# EAGLE design FMC_prototype (EAGLE 6.5.0)
DESIGNER: OPEN EPHYS; DESIGN_NAME: FMC ACQUISITION ADAPTER; REVISION: 0.1
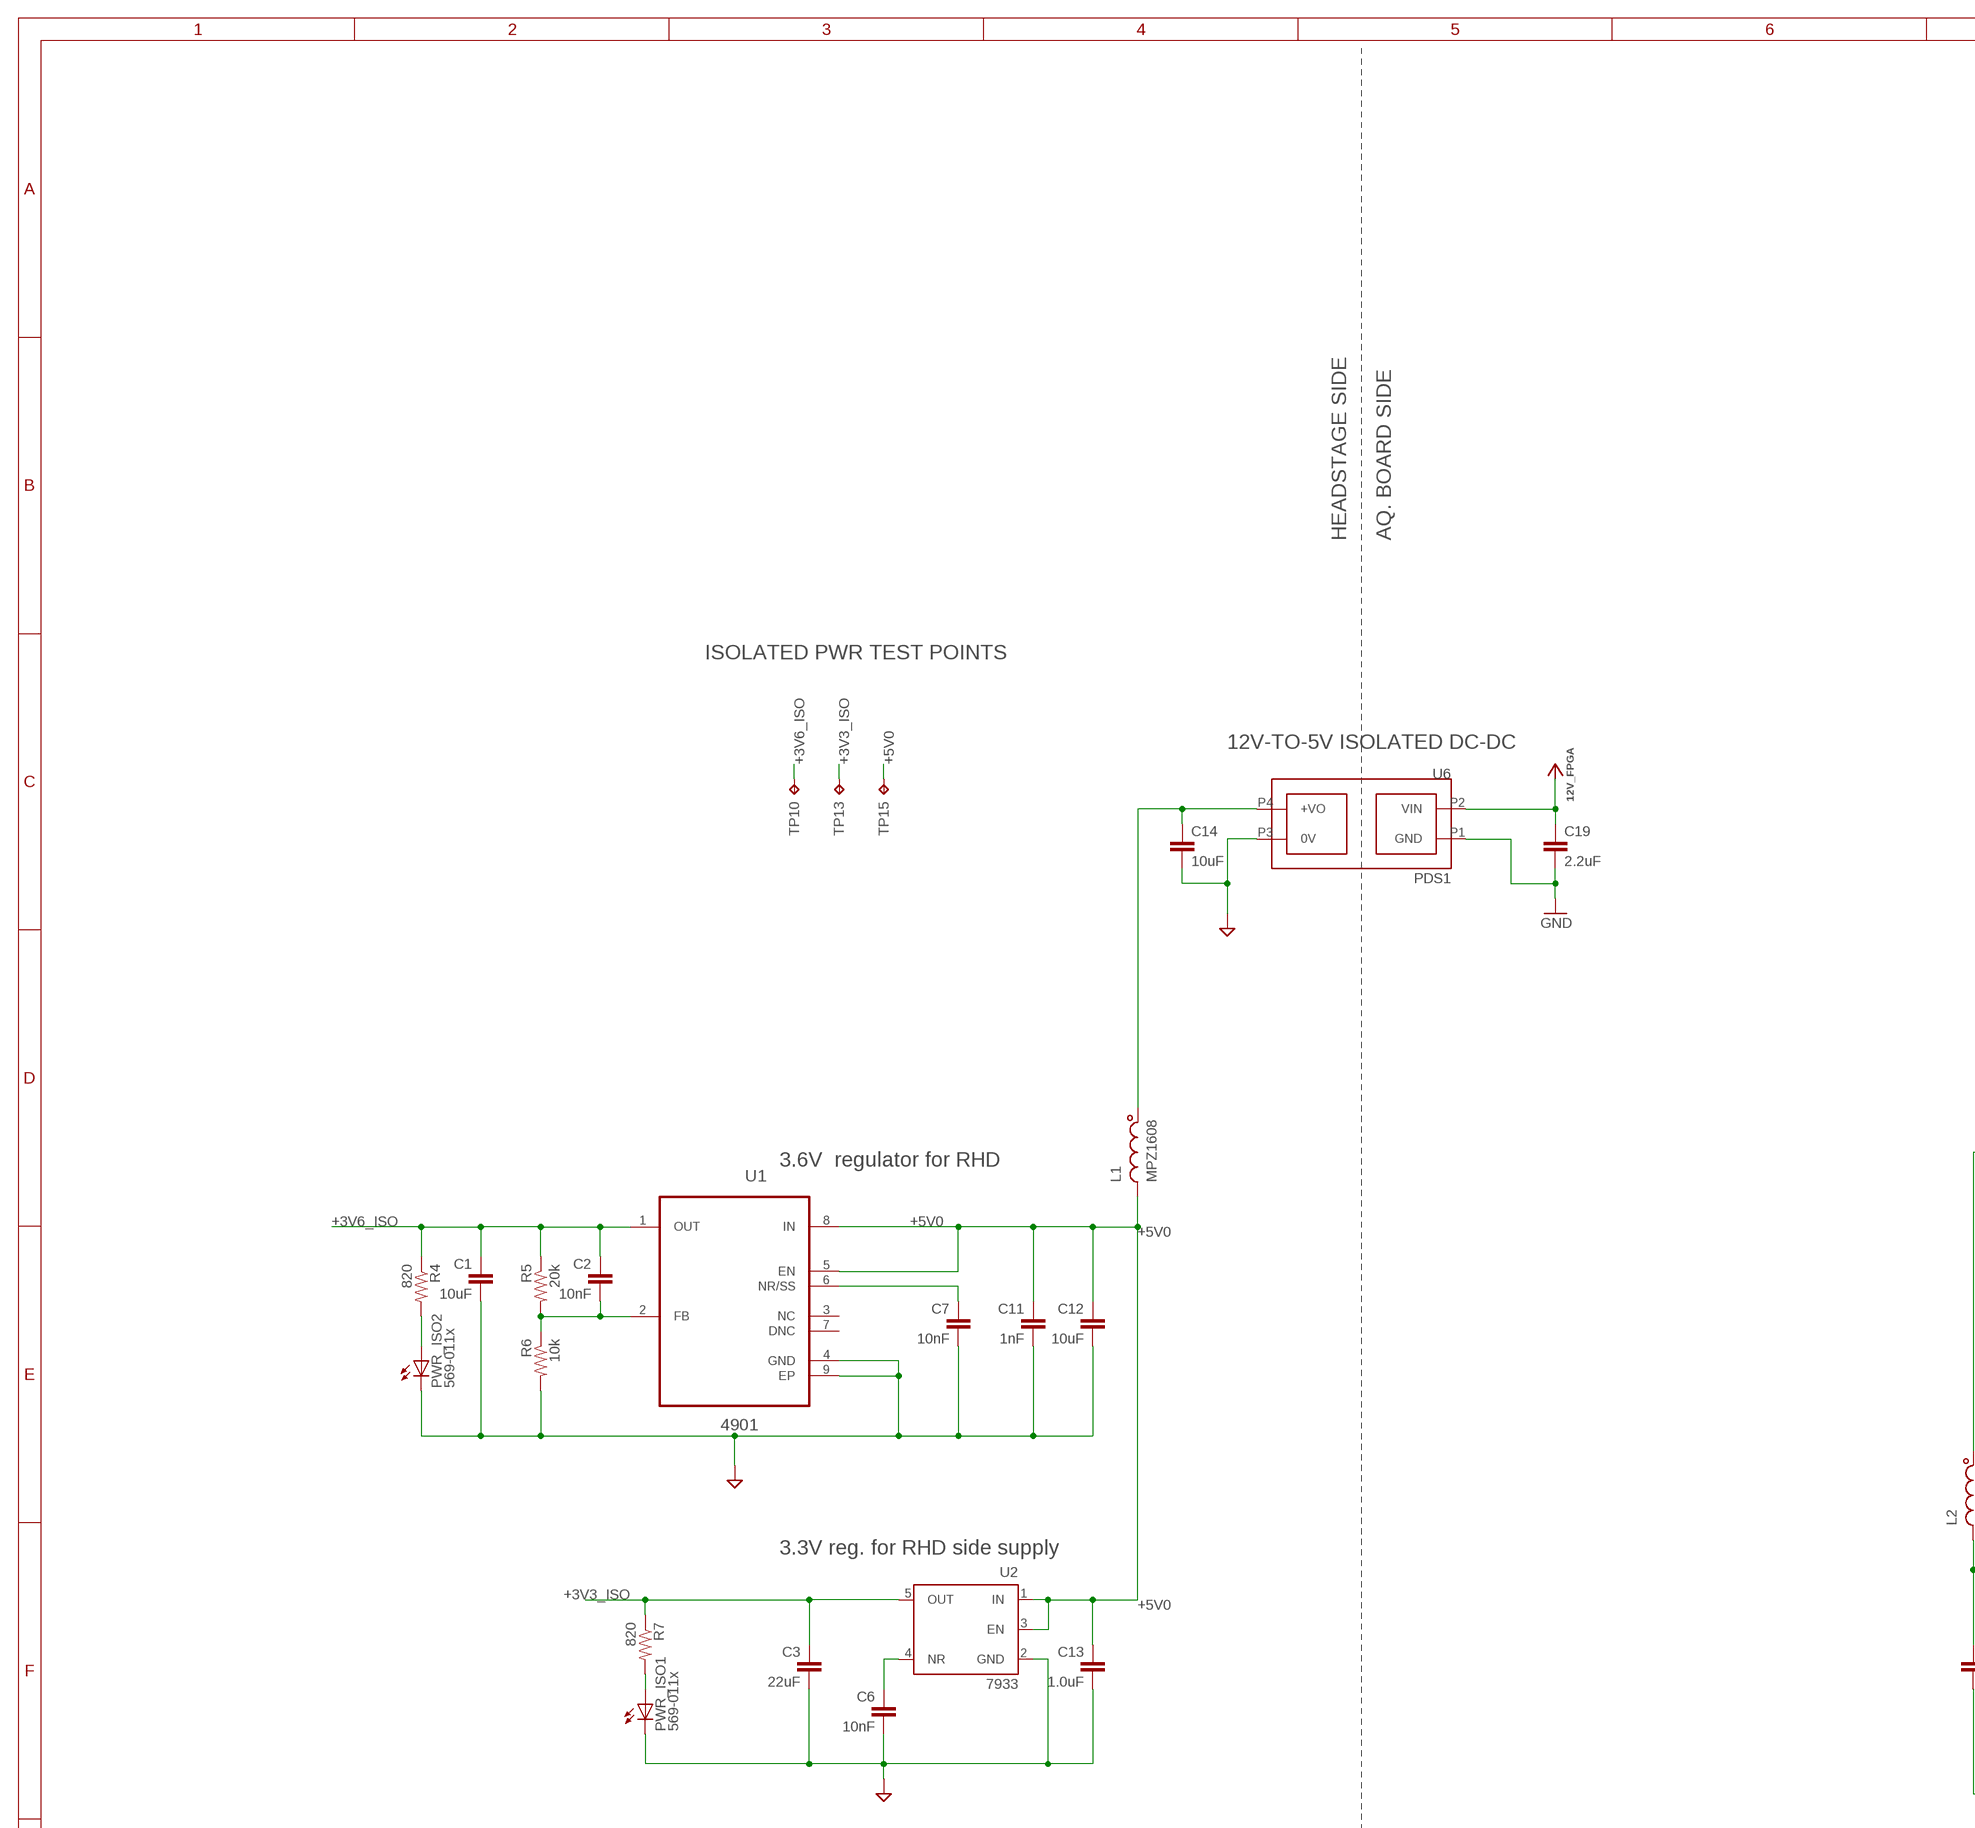
[diagram p0: schematic, sheet 1, part 1 of 3]
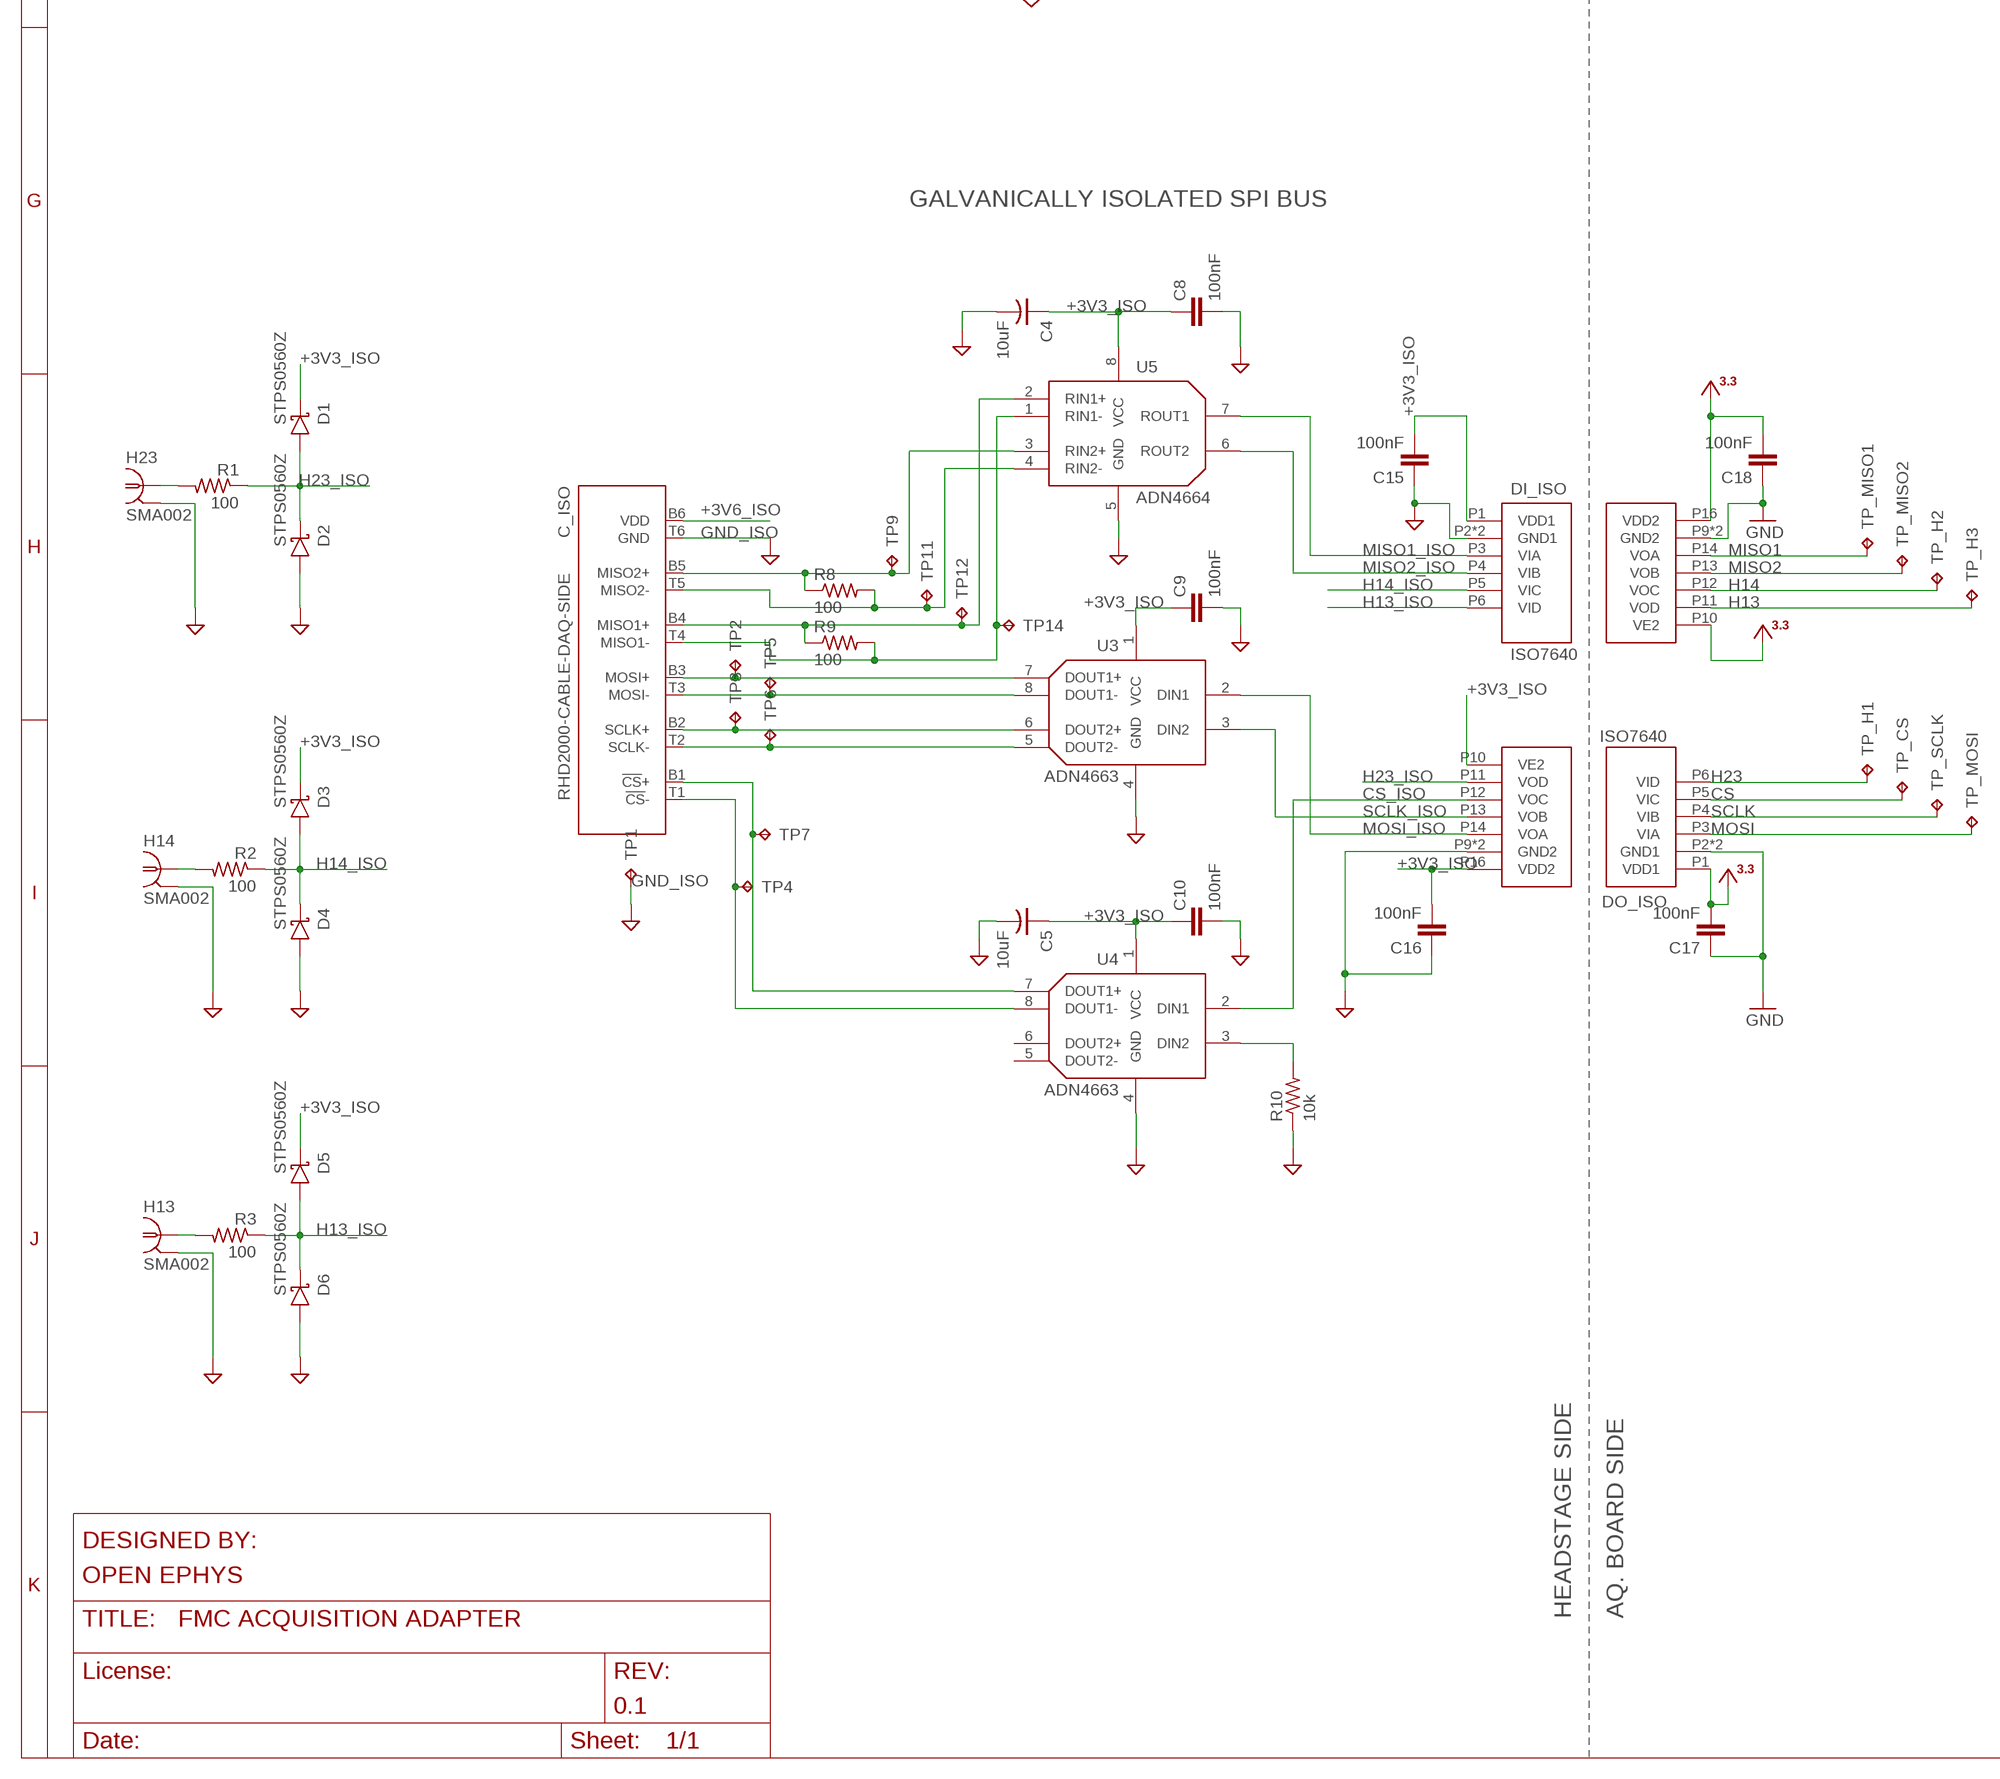
[diagram p1: schematic, sheet 1, part 2 of 3]
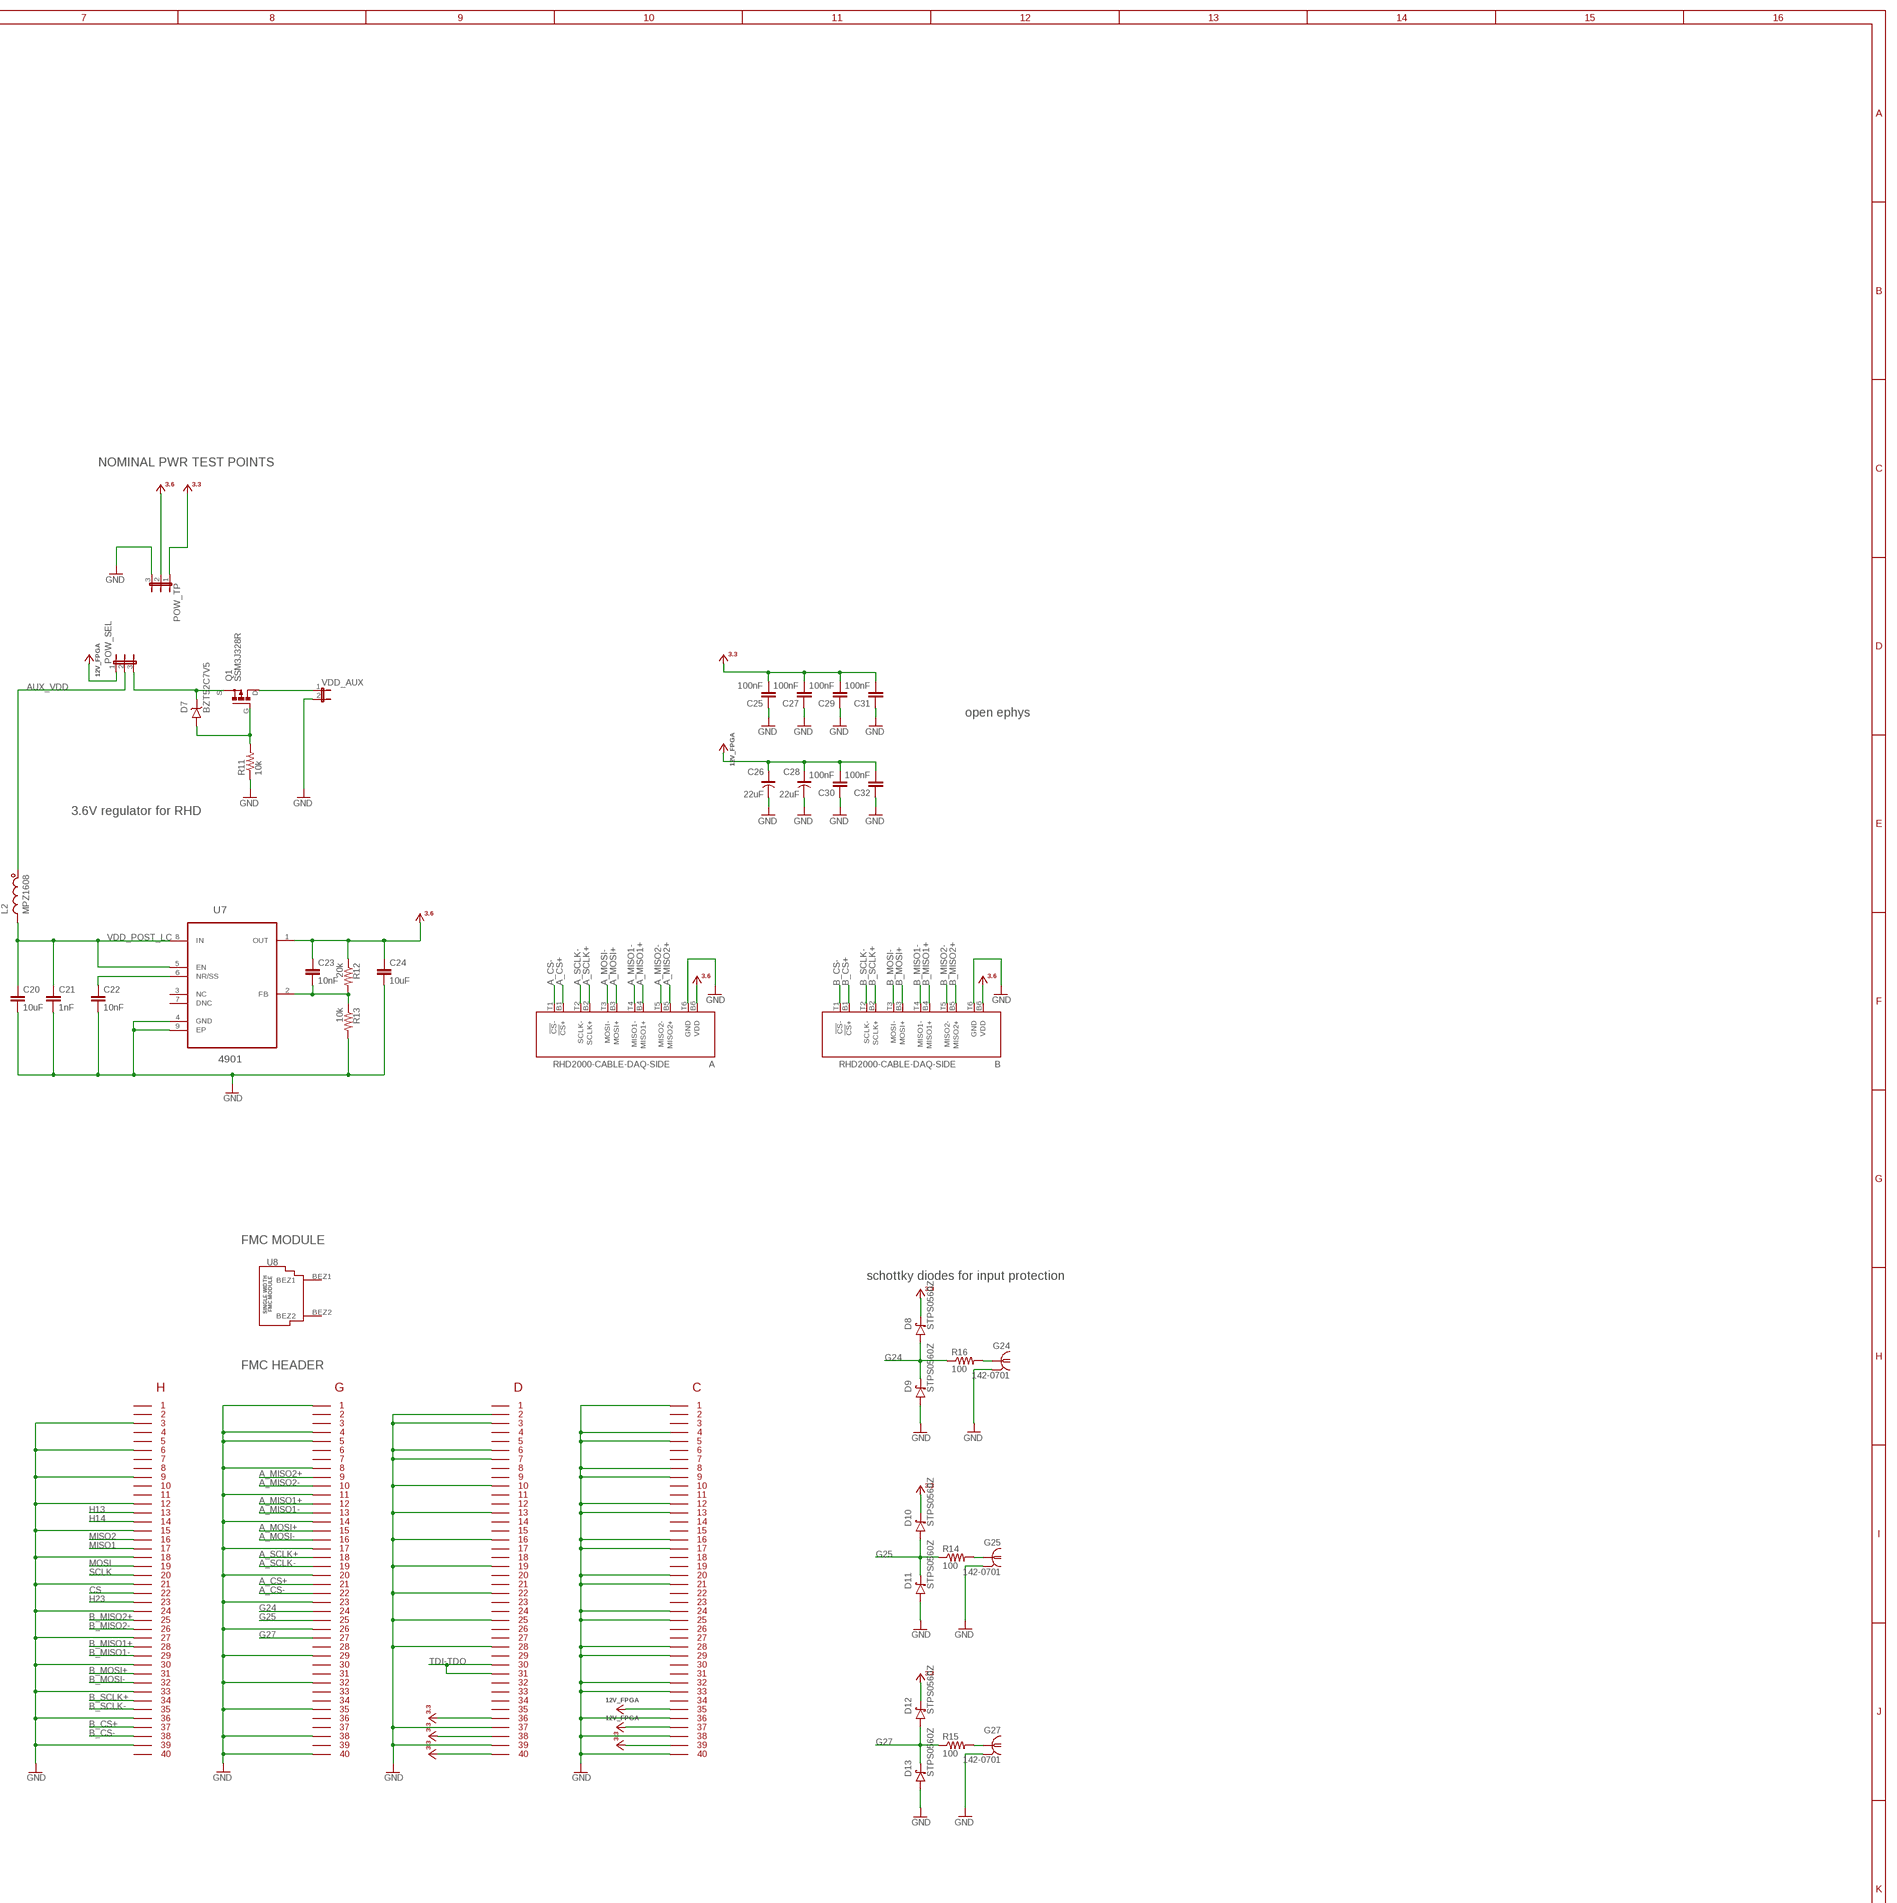
[diagram p2: schematic, sheet 1, part 3 of 3]

## Parts
A  RHD2000-CABLE-DAQ-SIDE  [OMNETICS_PZN-12-AA]
B  RHD2000-CABLE-DAQ-SIDE  [OMNETICS_PZN-12-AA]
C1  10uF  C_1206  [1206]
C2  10nF  C_0603  [0603]
C3  22uF  C_1206  [1206]
C4  10uF  C-POL_1206  [1206-POL]
C5  10uF  C-POL_1206  [1206-POL]
C6  10nF  C_0603  [0603]
C7  10nF  C_0603  [0603]
C8  100nF  C_0603  [0603]
C9  100nF  C_0603  [0603]
C10  100nF  C_0603  [0603]
C11  1nF  C_0603  [0603]
C12  10uF  C_1206  [1206]
C13  1.0uF  C_0805  [0805]
C14  10uF  C_1206  [1206]
C15  100nF  C_0603  [0603]
C16  100nF  C_0603  [0603]
C17  100nF  C_0603  [0603]
C18  100nF  C_0603  [0603]
C19  2.2uF  C_1206  [1206]
C20  10uF  C_1206  [1206]
C21  1nF  C_0603  [0603]
C22  10nF  C_0603  [0603]
C23  10nF  C_0603  [0603]
C24  10uF  C_1206  [1206]
C25  100nF  C_0603  [0603]
C26  22uF  C-POL_1210  [1210-POL]
C27  100nF  C_0603  [0603]
C28  22uF  C-POL_1210  [1210-POL]
C29  100nF  C_0603  [0603]
C30  100nF  C_0603  [0603]
C31  100nF  C_0603  [0603]
C32  100nF  C_0603  [0603]
C_ISO  RHD2000-CABLE-DAQ-SIDE  [OMNETICS_PZN-12-AA]
D1  STPS0560Z  S-DIODESOD-123  [SOD123]
D2  STPS0560Z  S-DIODESOD-123  [SOD123]
D3  STPS0560Z  S-DIODESOD-123  [SOD123]
D4  STPS0560Z  S-DIODESOD-123  [SOD123]
D5  STPS0560Z  S-DIODESOD-123  [SOD123]
D6  STPS0560Z  S-DIODESOD-123  [SOD123]
D7  BZT52C7V5  Z-DIODE_SOD123  [SOD123]
D8  STPS0560Z  S-DIODESOD-123  [SOD123]
D9  STPS0560Z  S-DIODESOD-123  [SOD123]
D10  STPS0560Z  S-DIODESOD-123  [SOD123]
D11  STPS0560Z  S-DIODESOD-123  [SOD123]
D12  STPS0560Z  S-DIODESOD-123  [SOD123]
D13  STPS0560Z  S-DIODESOD-123  [SOD123]
DI_ISO  ISO7640  ADUM3440  [SOIC_WIDE_16]
DO_ISO  ISO7640  ADUM3440  [SOIC_WIDE_16]
FMC  FMC_LPC_160_PIN  [FMC_LPC_MALE_WITH_SP601_BSILK]
G24  142-0701  COAX_SMA-VERT  [SMA_JACK_142-0701-201]
G25  142-0701  COAX_SMA-VERT  [SMA_JACK_142-0701-201]
G27  142-0701  COAX_SMA-VERT  [SMA_JACK_142-0701-201]
H13  SMA002  COAX_CONREVSMA002-G  [SMA_JACK_CONREVSMA002-G]
H14  SMA002  COAX_CONREVSMA002-G  [SMA_JACK_CONREVSMA002-G]
H23  SMA002  COAX_CONREVSMA002-G  [SMA_JACK_CONREVSMA002-G]
L1  MPZ1608  L_0603  [0603]
L2  MPZ1608  L_0603  [0603]
POW_SEL  JP3E  [JP3]
POW_TP  JP3E  [JP3]
PWR_ISO  569-011x  LED_2X_VERTICAL  [569-011X-X00_LED_ARRAY]
Q1  SSM3J328R  P-MOSFET_SOT23-GSD  [SOT23-GSD]
R1  100  R_0603  [0603]
R2  100  R_0603  [0603]
R3  100  R_0603  [0603]
R4  820  R_0603  [0603]
R5  20k  R_0603  [0603]
R6  10k  R_0603  [0603]
R7  820  R_0603  [0603]
R8  100  R_0603  [0603]
R9  100  R_0603  [0603]
R10  10k  R_0603  [0603]
R11  10k  R_0603  [0603]
R12  20k  R_0603  [0603]
R13  10k  R_0603  [0603]
R14  100  R_0603  [0603]
R15  100  R_0603  [0603]
R16  100  R_0603  [0603]
TP1  GND-ISO  TPPAD1-13  [P1-13]
TP2  MOSI+  TPTP06R  [TP06R]
TP3  SCLK+  TPTP06R  [TP06R]
TP4  CS-  TPTP06R  [TP06R]
TP5  MOSI-  TPTP06R  [TP06R]
TP6  SCLK-  TPTP06R  [TP06R]
TP7  CS+  TPTP06R  [TP06R]
TP9  MISO2+  TPTP06R  [TP06R]
TP10  +3V6  TPTP06R  [TP06R]
TP11  MISO2-  TPTP06R  [TP06R]
TP12  MISO1+  TPTP06R  [TP06R]
TP13  +3V3  TPTP06R  [TP06R]
TP14  MISO1-  TPTP06R  [TP06R]
TP15  +5V0  TPTP06R  [TP06R]
TP_CS  CS  TPTP06R  [TP06R]
TP_H1  H23  TPTP06R  [TP06R]
TP_H2  H14  TPTP06R  [TP06R]
TP_H3  H13  TPTP06R  [TP06R]
TP_MISO1  MISO1  TPTP06R  [TP06R]
TP_MISO2  MISO2  TPTP06R  [TP06R]
TP_MOSI  MOSI  TPTP06R  [TP06R]
TP_SCLK  SCLK  TPTP06R  [TP06R]
U1  4901  TPS7A4901DGNR  [SOP65P490X110-9N]
U2  7933  TPS79333  [SOT-23-5]
U3  ADN4663  ADN4663_SOIC  [SOIC127P500X400-8N]
U4  ADN4663  ADN4663_SOIC  [SOIC127P500X400-8N]
U5  ADN4664  ADN4664_SOIC  [SOIC127P500X400-8N]
U6  PDS1  [PDS1]
U7  4901  TPS7A4901DGNR  [SOP65P490X110-9N]
U8  FMC_SINGLE_WIDTH_MODULE  [FMC_SINGLE_WIDTH_MODULE]
U$1  OPEN_EPHYS_LOGO  [OPEN_EPHYS_LOGO]
VDD_AUX  JP2E_THRU-HOLE  [JP2]

## Nets
12V_FPGA: C19.1 C26.+ C28.+ C30.2 C32.2 FMC.P$155 FMC.P$157 POW_SEL.1 U6.P2(VIN)
+3V3: C17.2 C18.2 C25.2 C27.2 C29.2 C31.2 D8.C D10.C D12.C DI_ISO.P10(VE2) DI_ISO.P16(VDD2) DO_ISO.P1(VDD1) FMC.P$116 FMC.P$118 FMC.P$120 FMC.P$159 POW_TP.1
+3V3_ISO: C3.1 C4.+ C5.+ C8.1 C9.1 C10.1 C15.2 C16.2 D1.C D3.C D5.C DI_ISO.P1(VDD1) DO_ISO.P10(VE2) DO_ISO.P16(VDD2) R7.1 TP13.TP U2.5(OUT) U3.1(VCC) U4.1(VCC) U5.8(VCC)
+3V6: A.B6(VDD) B.B6(VDD) C23.1 C24.1 POW_TP.2 R12.1 U7.1(OUT)
+3V6_ISO: C1.1 C2.1 C_ISO.B6(VDD) R4.1 R5.1 TP10.TP U1.1(OUT)
+5V0: C11.1 C12.1 C13.1 L1.2 TP15.TP U1.5(EN) U1.8(IN) U2.1(IN) U2.3(EN)
+5V0_ISO-PRE: C14.1 L1.1 U6.P4(+VO)
A_CS+: A.B1(!CS!+) FMC.P$61
A_CS-: A.T1(!CS!-) FMC.P$62
A_MISO1+: A.B4(MISO1+) FMC.P$52
A_MISO1-: A.T4(MISO1-) FMC.P$53
A_MISO2+: A.B5(MISO2+) FMC.P$49
A_MISO2-: A.T5(MISO2-) FMC.P$50
A_MOSI+: A.B3(MOSI+) FMC.P$55
A_MOSI-: A.T3(MOSI-) FMC.P$56
A_SCLK+: A.B2(SCLK+) FMC.P$58
A_SCLK-: A.T2(SCLK-) FMC.P$59
AGND1: C23.2 R12.2 R13.1 U7.2(FB)
AGND2: C2.2 R5.2 R6.1 U1.2(FB)
AUX_VDD: L2.1 POW_SEL.2
B_CS+: B.B1(!CS!+) FMC.P$37
B_CS-: B.T1(!CS!-) FMC.P$38
B_MISO1+: B.B4(MISO1+) FMC.P$28
B_MISO1-: B.T4(MISO1-) FMC.P$29
B_MISO2+: B.B5(MISO2+) FMC.P$25
B_MISO2-: B.T5(MISO2-) FMC.P$26
B_MOSI+: B.B3(MOSI+) FMC.P$31
B_MOSI-: B.T3(MOSI-) FMC.P$32
B_SCLK+: B.B2(SCLK+) FMC.P$34
B_SCLK-: B.T2(SCLK-) FMC.P$35
CS: DO_ISO.P5(VIC) FMC.P$22 TP_CS.TP
CS+_ISOLATED: C_ISO.B1(!CS!+) TP7.TP U4.7(DOUT1+)
CS-_ISOLATED: C_ISO.T1(!CS!-) TP4.TP U4.8(DOUT1-)
CS_ISO: DO_ISO.P12(VOC) U4.2(DIN1)
G24: D8.A D9.C FMC.P$64 R16.1
G25: D10.A D11.C FMC.P$65 R14.1
G27: D12.A D13.C FMC.P$67 R15.1
GND: A.T6(GND) B.T6(GND) C17.1 C18.1 C19.2 C20.2 C21.2 C22.2 C24.2 C25.1 C26.- C27.1 C28.- C29.1 C30.1 C31.1 C32.1 D9.A D11.A D13.A DI_ISO.P9(GND2) DI_ISO.P15(GND2) DO_ISO.P2(GND1) DO_ISO.P8(GND1) FMC.P$3 FMC.P$6 FMC.P$9 FMC.P$12 FMC.P$15 FMC.P$18 FMC.P$21 FMC.P$24 FMC.P$27 FMC.P$30 FMC.P$33 FMC.P$36 FMC.P$39 FMC.P$41 FMC.P$44 FMC.P$45 FMC.P$48 FMC.P$51 FMC.P$54 FMC.P$57 FMC.P$60 FMC.P$63 FMC.P$66 FMC.P$69 FMC.P$72 FMC.P$75 FMC.P$78 FMC.P$80 FMC.P$82 FMC.P$83 FMC.P$86 FMC.P$87 FMC.P$90 FMC.P$93 FMC.P$96 FMC.P$99 FMC.P$102 FMC.P$105 FMC.P$108 FMC.P$117 FMC.P$119 FMC.P$121 FMC.P$124 FMC.P$125 FMC.P$128 FMC.P$129 FMC.P$132 FMC.P$133 FMC.P$136 FMC.P$137 FMC.P$140 FMC.P$141 FMC.P$144 FMC.P$145 FMC.P$148 FMC.P$149 FMC.P$152 FMC.P$153 FMC.P$156 FMC.P$158 FMC.P$160 G24.GND$1 G24.GND$2 G24.GND$3 G24.GND$4 G25.GND$1 G25.GND$2 G25.GND$3 G25.GND$4 G27.GND$1 G27.GND$2 G27.GND$3 G27.GND$4 POW_TP.3 R11.1 R13.2 U6.P1(GND) U7.4(GND) U7.9(EP) VDD_AUX.2
GND_ISO: C1.2 C3.2 C4.- C5.- C6.2 C7.2 C8.2 C9.2 C10.2 C11.2 C12.2 C13.2 C14.2 C15.1 C16.1 C_ISO.T6(GND) D2.A D4.A D6.A DI_ISO.P2(GND1) DI_ISO.P8(GND1) DO_ISO.P9(GND2) DO_ISO.P15(GND2) H13.GND$1 H13.GND$2 H13.GND$3 H13.GND$4 H14.GND$1 H14.GND$2 H14.GND$3 H14.GND$4 H23.GND$1 H23.GND$2 H23.GND$3 H23.GND$4 PWR_ISO.C1(1:C) PWR_ISO.C2(2:C) R6.2 R10.1 TP1.TP U1.4(GND) U1.9(EP) U2.2(GND) U3.4(GND) U4.4(GND) U5.5(GND) U6.P3(0V)
H13: DI_ISO.P11(VOD) FMC.P$13 TP_H3.TP
H13_ISO: D5.A D6.C DI_ISO.P6(VID) R3.1
H14: DI_ISO.P12(VOC) FMC.P$14 TP_H2.TP
H14_ISO: D3.A D4.C DI_ISO.P5(VIC) R2.1
H23: DO_ISO.P6(VID) FMC.P$23 TP_H1.TP
H23_ISO: D1.A D2.C DO_ISO.P11(VOD) R1.1
MISO1: DI_ISO.P14(VOA) FMC.P$17 TP_MISO1.TP
MISO1+_ISOLATED: C_ISO.B4(MISO1+) R9.1 TP12.TP U5.2(RIN1+)
MISO1-_ISOLATED: C_ISO.T4(MISO1-) R9.2 TP14.TP U5.1(RIN1-)
MISO1_ISO: DI_ISO.P3(VIA) U5.7(ROUT1)
MISO2: DI_ISO.P13(VOB) FMC.P$16 TP_MISO2.TP
MISO2+_ISOLATED: C_ISO.B5(MISO2+) R8.1 TP9.TP U5.3(RIN2+)
MISO2-_ISOLATED: C_ISO.T5(MISO2-) R8.2 TP11.TP U5.4(RIN2-)
MISO2_ISO: DI_ISO.P4(VIB) U5.6(ROUT2)
MOSI: DO_ISO.P3(VIA) FMC.P$19 TP_MOSI.TP
MOSI_ISO: DO_ISO.P14(VOA) U3.2(DIN1)
N$1: C22.1 U7.6(NR/SS)
N$2: G24.CLK R16.2
N$3: D7.C POW_SEL.3 Q1.S
N$4: C7.1 U1.6(NR/SS)
N$5: R10.2 U4.3(DIN2)
N$6: D7.A Q1.G R11.2
N$7: Q1.D VDD_AUX.1
N$8: PWR_ISO.A2(2:A) R4.2
N$10: PWR_ISO.A1(1:A) R7.2
N$11: H23.CLK R1.2
N$12: C_ISO.B3(MOSI+) TP2.TP U3.7(DOUT1+)
N$13: C_ISO.T3(MOSI-) TP5.TP U3.8(DOUT1-)
N$14: H14.CLK R2.2
N$15: C_ISO.B2(SCLK+) TP3.TP U3.6(DOUT2+)
N$16: C_ISO.T2(SCLK-) TP6.TP U3.5(DOUT2-)
N$17: H13.CLK R3.2
N$18: G25.CLK R14.2
N$19: G27.CLK R15.2
N$97: C6.1 U2.4(NR)
SCLK: DO_ISO.P4(VIB) FMC.P$20 TP_SCLK.TP
SCLK_ISO: DO_ISO.P13(VOB) U3.3(DIN2)
TDI-TDO: FMC.P$110 FMC.P$111
VDD_POST_LC: C20.1 C21.1 L2.2 U7.5(EN) U7.8(IN)
Unconnected: FMC.P$1 FMC.P$2 FMC.P$4 FMC.P$5 FMC.P$7 FMC.P$8 FMC.P$10 FMC.P$11 FMC.P$40 FMC.P$42 FMC.P$43 FMC.P$46 FMC.P$47 FMC.P$68 FMC.P$70 FMC.P$71 FMC.P$73 FMC.P$74 FMC.P$76 FMC.P$77 FMC.P$79 FMC.P$81 FMC.P$84 FMC.P$85 FMC.P$88 FMC.P$89 FMC.P$91 FMC.P$92 FMC.P$94 FMC.P$95 FMC.P$97 FMC.P$98 FMC.P$100 FMC.P$101 FMC.P$103 FMC.P$104 FMC.P$106 FMC.P$107 FMC.P$109 FMC.P$112 FMC.P$113 FMC.P$114 FMC.P$115 FMC.P$122 FMC.P$123 FMC.P$126 FMC.P$127 FMC.P$130 FMC.P$131 FMC.P$134 FMC.P$135 FMC.P$138 FMC.P$139 FMC.P$142 FMC.P$143 FMC.P$146 FMC.P$147 FMC.P$150 FMC.P$151 FMC.P$154 U1.3(NC) U1.7(DNC) U4.5(DOUT2-) U4.6(DOUT2+) U7.3(NC) U7.7(DNC) U8.BEZ1 U8.BEZ2

## Notes on the sheet
- HEADSTAGE SIDE | AQ. BOARD SIDE
- ISOLATED PWR TEST POINTS
- 12V-TO-5V ISOLATED DC-DC
- NOMINAL PWR TEST POINTS
- 3.6V  regulator for RHD
- 3.6V regulator for RHD
- 3.3V reg. for RHD side supply
- GALVANICALLY ISOLATED SPI BUS
- FMC MODULE
- schottky diodes for input protection
- FMC HEADER
- HEADSTAGE SIDE | AQ. BOARD SIDE

## Power pins joined to a net without a drawn wire
GND: FMC.GNDA(GND$1:GND) FMC.GNDB(GND$2:GND)

## Library data of the parts
A B C_ISO = RHD2000_eval_board:RHD2000-CABLE-DAQ-SIDE: Omnetics PZN-12-AA RHD2000 socket - DAQ side
C1 C12 C20 C24 = puggleboard:C: Capacitor
C2 C7 C11 C14 C19 C21-C23 = jonnew:C: Capacitor
C3 C6 C8-C10 C13 C15-C18 C25 C27 C29-C32 = RHD2000_eval_board:C: Capacitor
C4 C5 C26 C28 = jonnew:C-POL: Polarized Capacitor
D1-D6 D8-D13 = jonnew:S-DIODE: Schottky Diode
D7 = jonnew:Z-DIODE: Zener Diode
DI_ISO DO_ISO = jonnew:ADUM3440
FMC = jonnew:FMC_LPC_160_PIN
G24 G25 G27 H13 H14 H23 = jonnew:COAX: COAX CONNECTOR - Edge mount BNC - Vertical BNC - Vertical SMA - etc
L1 L2 = jonnew:L: Inductor
POW_SEL POW_TP = jonnew:JP3E
PWR_ISO = jonnew:LED_2X
Q1 = jonnew:P-MOSFET
R1-R3 R5 R6 R10-R16 = jonnew:R: Resistor; DK: PxxxxHTR-ND; MN: Panasonic; MPN: ERJ-3EKFxxxxV
R4 R7-R9 = RHD2000_eval_board:R: Resistor
TP1-TP7 TP9-TP15 TP_CS TP_H1-TP_H3 TP_MISO1 TP_MISO2 TP_MOSI TP_SCLK = jonnew:TP: Test pad
U1 U7 = jonnew:TPS7A4901DGNR: ?36V, ?200mA, Ultralow-Noise, Negative LINEAR REGULATOR; MPN: TPS7A4901DGNR; OC_FARNELL: -; OC_NEWARK: 01T0879; PACKAGE: MSOP-8; SUPPLIER: Texas Instruments
U2 = jonnew:TPS79333: Texas Instruments TPS79333 3.3V LDO regulator
U3 U4 = jonnew:ADN4663: Dual 3V3 CMOS to LVDS differential line driver
U5 = jonnew:ADN4664: Dual LVLDS to 3V3 CMOS differential line receiver
U6 = jonnew:PDS1: CUI inc. DC-DC converter, see http://www.cui.com/product/resource/pds1-s.pdf
U8 = jonnew:FMC_SINGLE_WIDTH_MODULE
U$1 = open-ephys:OPEN_EPHYS_LOGO: Open Ephys logo
VDD_AUX = jonnew:JP2E

## Board
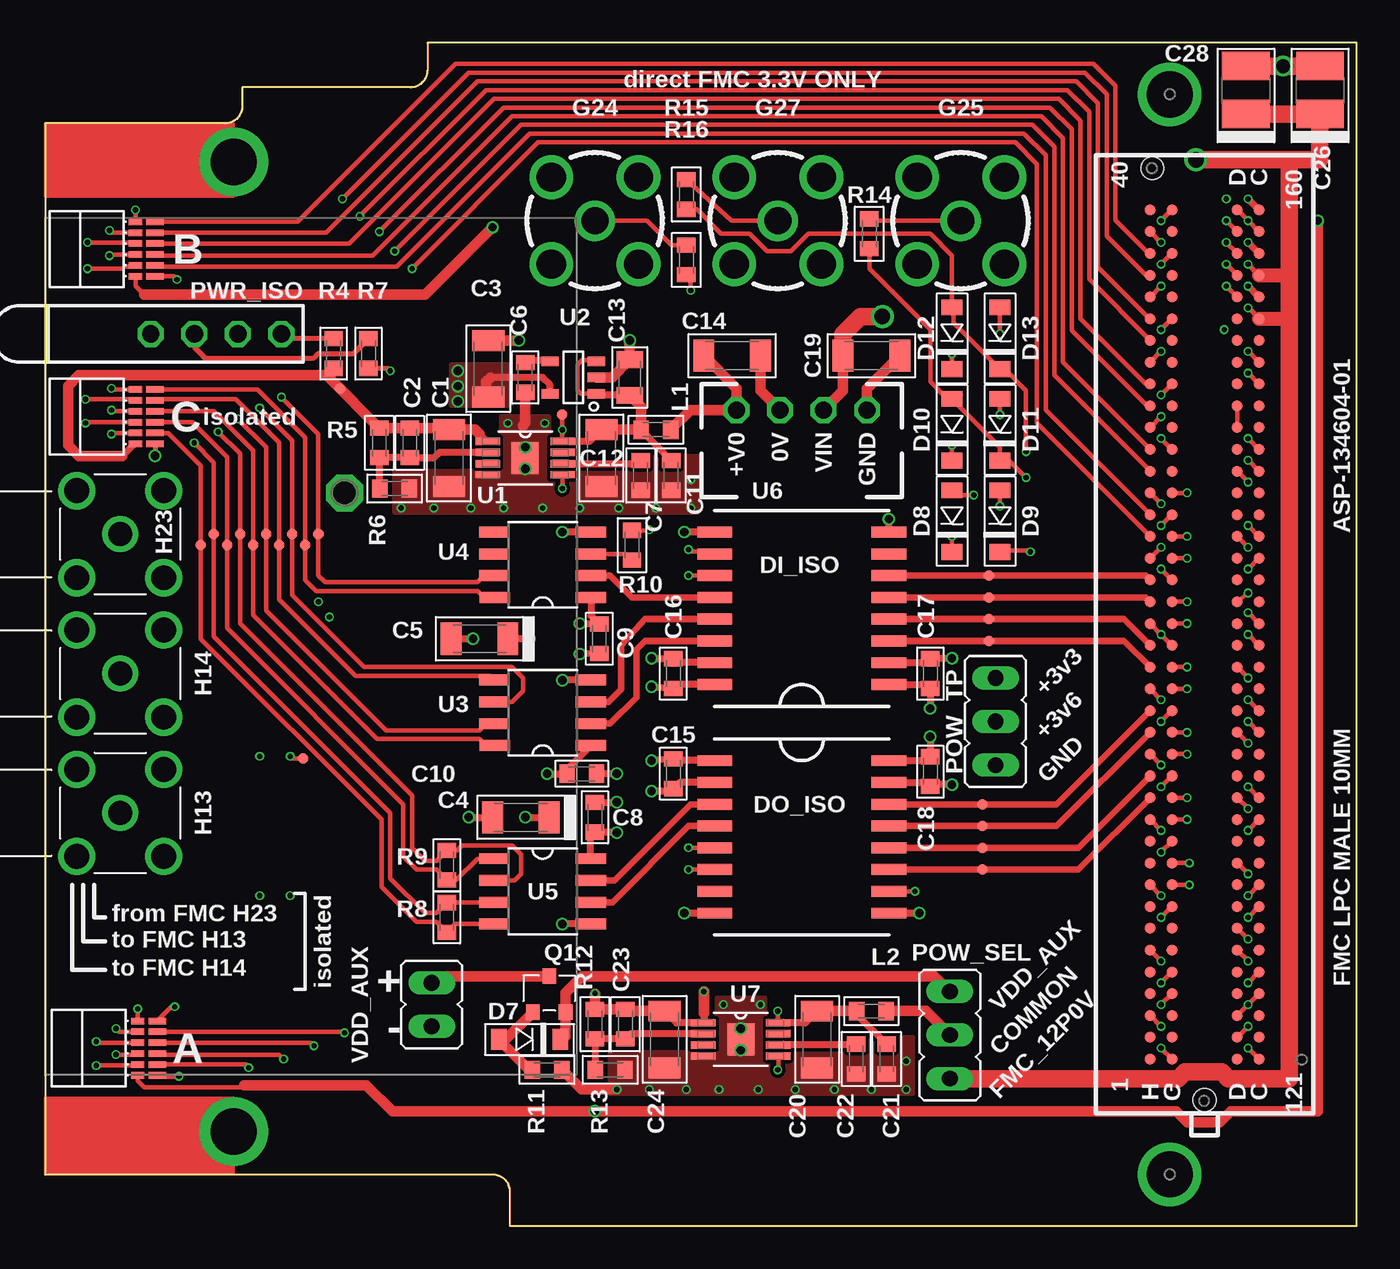
[diagram p3: board, top side]
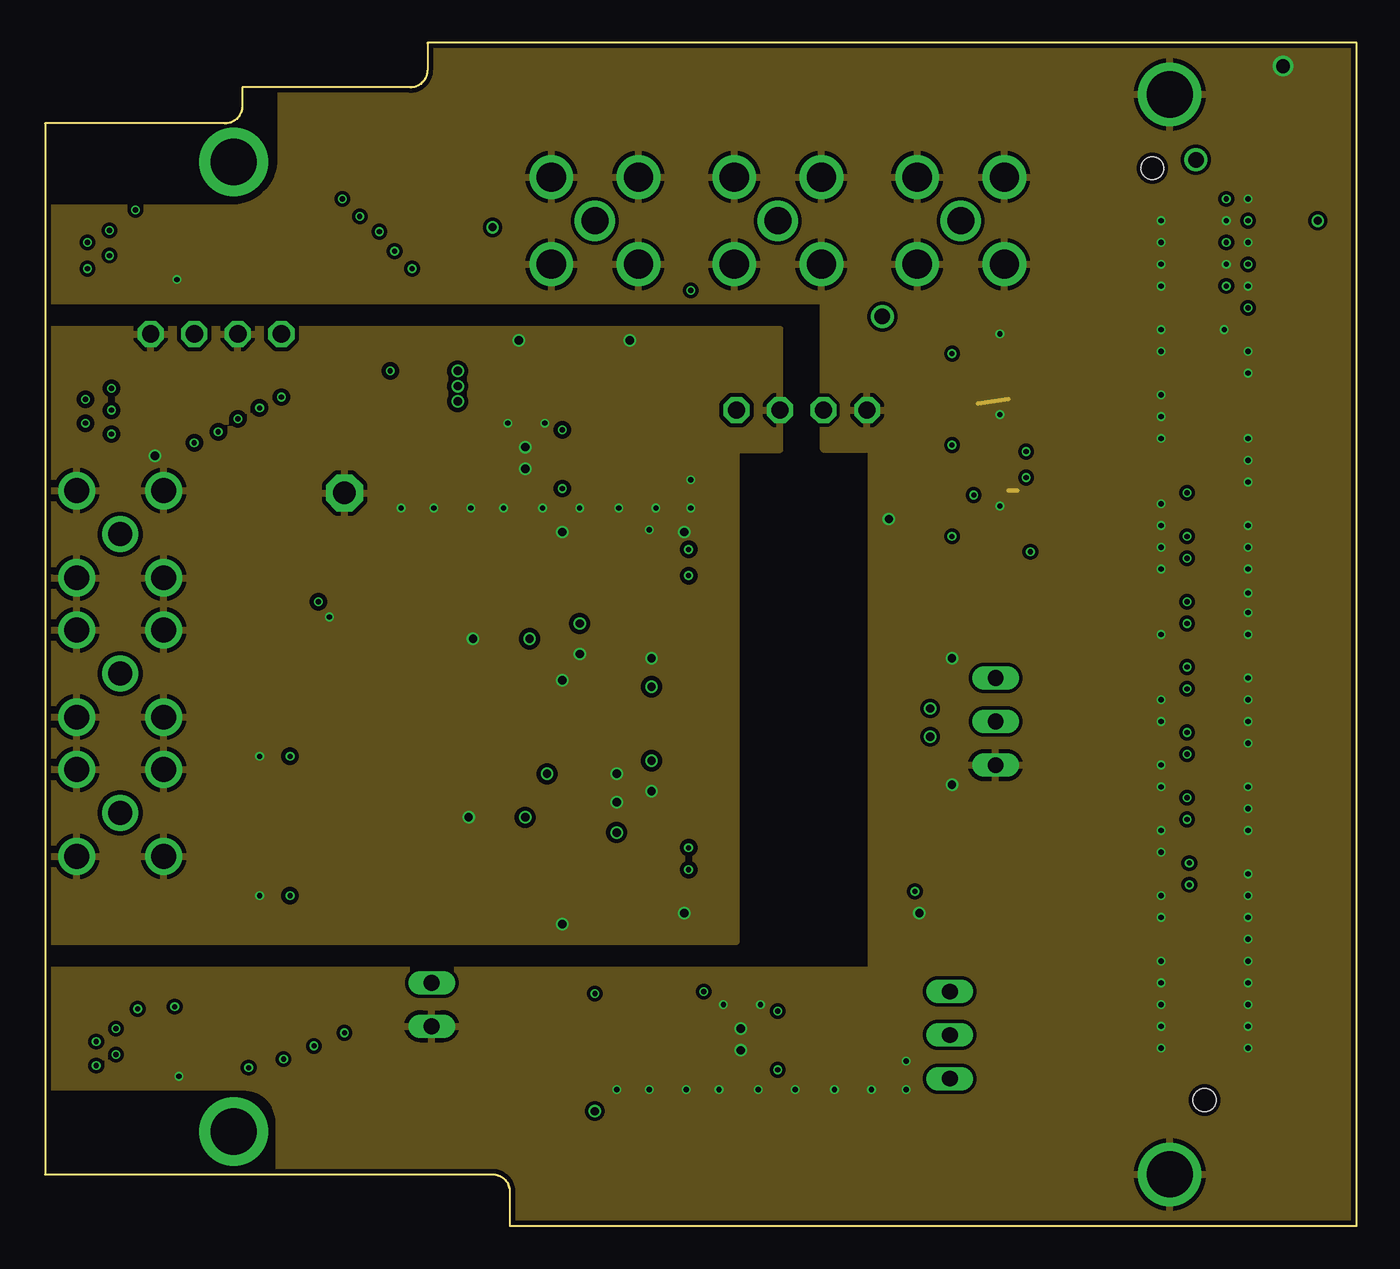
[diagram p4: board, inner layer $GND]
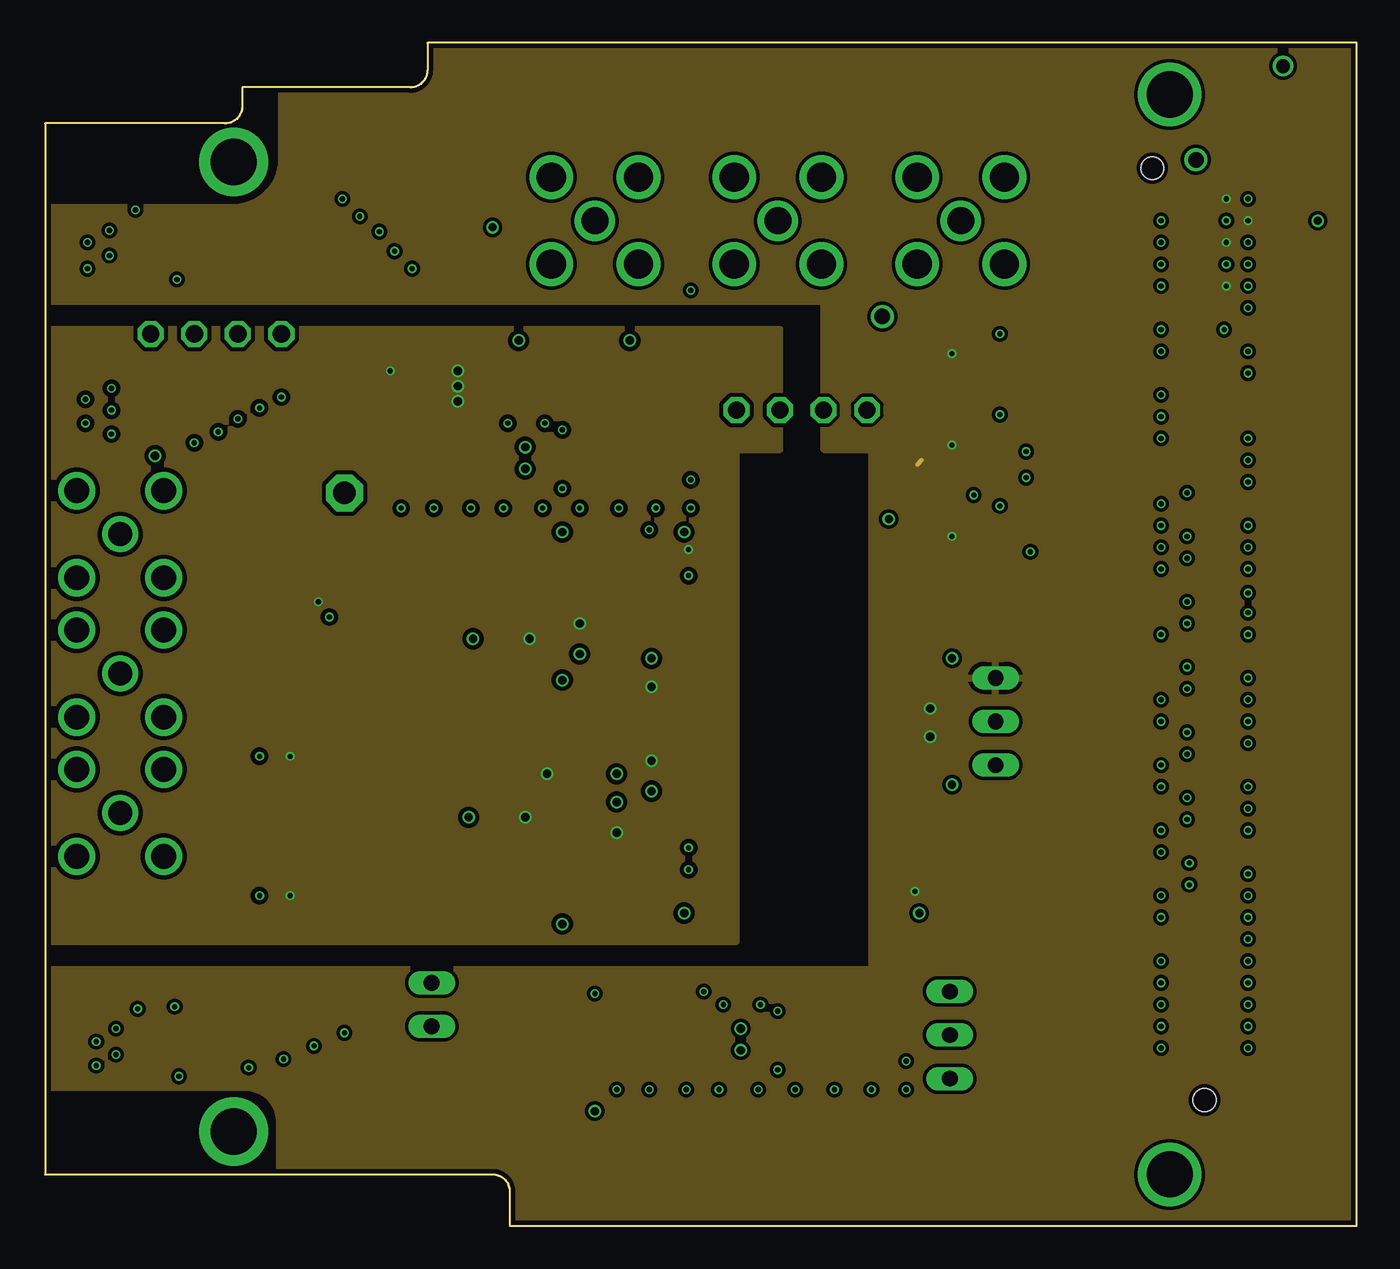
[diagram p5: board, inner layer $VCC]
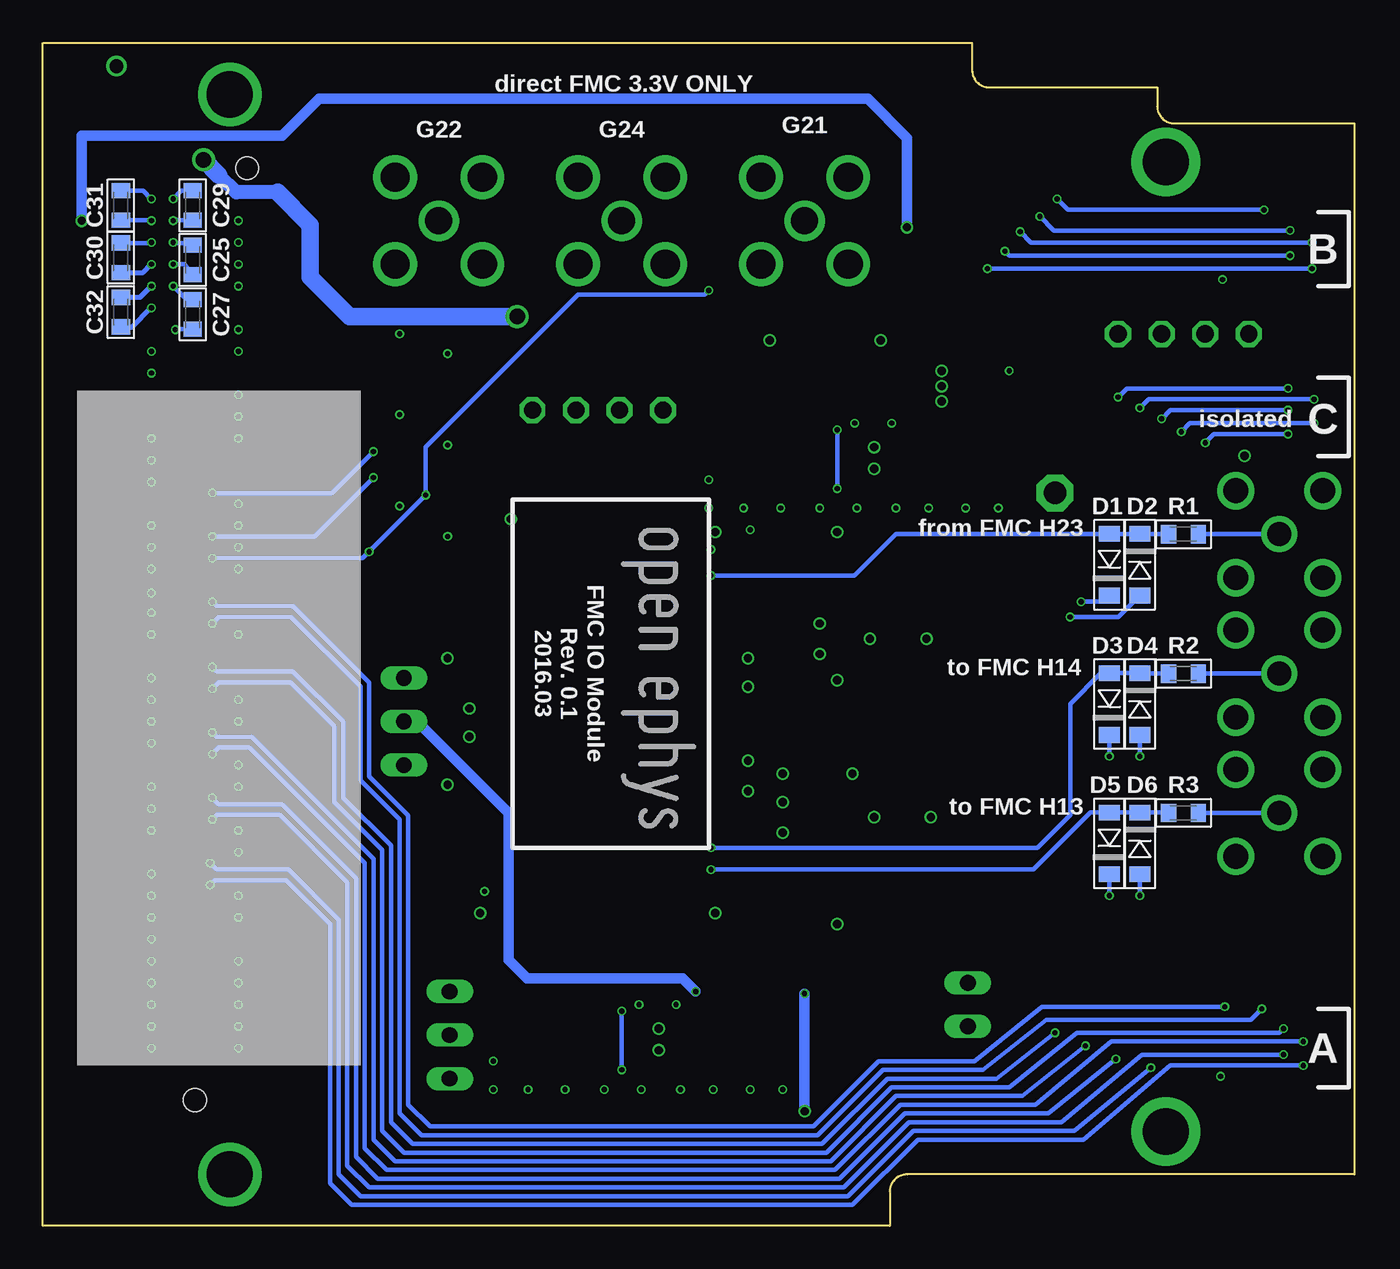
[diagram p6: board, bottom side, seen from below]

Size 76.5 x 69 mm. Coordinates in mm from the lower left corner, seen from the top.
Copper layers (1*2*15*16): Top 0.035mm / dielectric 0.2mm / $GND 0.0175mm / dielectric 0.3mm / $VCC 0.0175mm / dielectric 0.2mm / Bottom 0.035mm
Design rules "seeed-studio-4-layer": minimum track width 8mil, minimum drill 12mil, track to track 8mil, track to pad 8mil, pad to pad 8mil, via to via 8mil, smd to smd 0mil, copper to edge 10mil, drill to drill 8mil, minimum pad ring 6mil, minimum via ring 4mil, stop-mask expansion 4mil, vias tented up to drill 100mil, thermal gap 10mil

### Footprints (pad centres in the part's own frame; a part is rotated, then mirrored left to right if it is on the bottom)
OMNETICS_PZN-12-AA = smd 0.381 x 0.762: B1 1.587,-1.016; B2 0.953,-1.016; B3 0.318,-1.016; B4 -0.318,-1.016; B5 -0.953,-1.016; B6 -1.587,-1.016 | smd 0.381 x 1.016: T1 1.587,-2.159; T2 0.953,-2.159; T3 0.318,-2.159; T4 -0.318,-2.159; T5 -0.953,-2.159; T6 -1.587,-2.159
1206 = smd 1.219 x 1.88: 1 -1.651,0; 2 1.651,0
0603 = smd 0.889 x 1.067: 1 -0.864,0; 2 0.864,0
1206-POL = smd 1.219 x 1.88: + -1.651,0; - 1.651,0
0805 = smd 0.965 x 1.524: 1 -1.041,0; 2 1.041,0
1210-POL = smd 1.651 x 2.794: + -1.397,0; - 1.397,0
SOD123 = smd 0.914 x 1.219: A -1.8,0; C 1.8,0
SOIC_WIDE_16 = smd 0.635 x 2.032: P1 -4.445,-5.08; P2 -3.175,-5.08; P3 -1.905,-5.08; P4 -0.635,-5.08; P5 0.635,-5.08; P6 1.905,-5.08; P7 3.175,-5.08; P8 4.445,-5.08; P9 4.445,5.08; P10 3.175,5.08; P11 1.905,5.08; P12 0.635,5.08; P13 -0.635,5.08; P14 -1.905,5.08; P15 -3.175,5.08; P16 -4.445,5.08
FMC_LPC_MALE_WITH_SP601_BSILK = drill 2.692: GNDA -31.496,2.032; GNDB 31.496,2.032 | smd 0.635 x 0.635 bottom: P$1 24.765,3.175; P$2 23.495,3.175; P$3 22.225,3.175; P$4 20.955,3.175; P$5 19.685,3.175; P$6 18.415,3.175; P$7 17.145,3.175; P$8 15.875,3.175; P$9 14.605,3.175; P$10 13.335,3.175; P$11 12.065,3.175; P$12 10.795,3.175; P$13 9.525,3.175; P$14 8.255,3.175; P$15 6.985,3.175; P$16 5.715,3.175; P$17 4.445,3.175; P$18 3.175,3.175; P$19 1.905,3.175; P$20 0.635,3.175; P$21 -0.635,3.175; P$22 -1.905,3.175; P$23 -3.175,3.175; P$24 -4.445,3.175; P$25 -5.715,3.175; P$26 -6.985,3.175; P$27 -8.255,3.175; P$28 -9.525,3.175; P$29 -10.795,3.175; P$30 -12.065,3.175; P$31 -13.335,3.175; P$32 -14.605,3.175; P$33 -15.875,3.175; P$34 -17.145,3.175; P$35 -18.415,3.175; P$36 -19.685,3.175; P$37 -20.955,3.175; P$38 -22.225,3.175; P$39 -23.495,3.175; P$40 -24.765,3.175; P$41 24.765,1.905; P$42 23.495,1.905; P$43 22.225,1.905; P$44 20.955,1.905; P$45 19.685,1.905; P$46 18.415,1.905; P$47 17.145,1.905; P$48 15.875,1.905; P$49 14.605,1.905; P$50 13.335,1.905; P$51 12.065,1.905; P$52 10.795,1.905; P$53 9.525,1.905; P$54 8.255,1.905; P$55 6.985,1.905; P$56 5.715,1.905; P$57 4.445,1.905; P$58 3.175,1.905; P$59 1.905,1.905; P$60 0.635,1.905; P$61 -0.635,1.905; P$62 -1.905,1.905; P$63 -3.175,1.905; P$64 -4.445,1.905; P$65 -5.715,1.905; P$66 -6.985,1.905; P$67 -8.255,1.905; P$68 -9.525,1.905; P$69 -10.795,1.905; P$70 -12.065,1.905; P$71 -13.335,1.905; P$72 -14.605,1.905; P$73 -15.875,1.905; P$74 -17.145,1.905; P$75 -18.415,1.905; P$76 -19.685,1.905; P$77 -20.955,1.905; P$78 -22.225,1.905; P$79 -23.495,1.905; P$80 -24.765,1.905; P$81 24.765,-1.905; P$82 23.495,-1.905; P$83 22.225,-1.905; P$84 20.955,-1.905; P$85 19.685,-1.905; P$86 18.415,-1.905; P$87 17.145,-1.905; P$88 15.875,-1.905; P$89 14.605,-1.905; P$90 13.335,-1.905; P$91 12.065,-1.905; P$92 10.795,-1.905; P$93 9.525,-1.905; P$94 8.255,-1.905; P$95 6.985,-1.905; P$96 5.715,-1.905; P$97 4.445,-1.905; P$98 3.175,-1.905; P$99 1.905,-1.905; P$100 0.635,-1.905; P$101 -0.635,-1.905; P$102 -1.905,-1.905; P$103 -3.175,-1.905; P$104 -4.445,-1.905; P$105 -5.715,-1.905; P$106 -6.985,-1.905; P$107 -8.255,-1.905; P$108 -9.525,-1.905; P$109 -10.795,-1.905; P$110 -12.065,-1.905; P$111 -13.335,-1.905; P$112 -14.605,-1.905; P$113 -15.875,-1.905; P$114 -17.145,-1.905; P$115 -18.415,-1.905; P$116 -19.685,-1.905; P$117 -20.955,-1.905; P$118 -22.225,-1.905; P$119 -23.495,-1.905; P$120 -24.765,-1.905; P$121 24.765,-3.175; P$122 23.495,-3.175; P$123 22.225,-3.175; P$124 20.955,-3.175; P$125 19.685,-3.175; P$126 18.415,-3.175; P$127 17.145,-3.175; P$128 15.875,-3.175; P$129 14.605,-3.175; P$130 13.335,-3.175; P$131 12.065,-3.175; P$132 10.795,-3.175; P$133 9.525,-3.175; P$134 8.255,-3.175; P$135 6.985,-3.175; P$136 5.715,-3.175; P$137 4.445,-3.175; P$138 3.175,-3.175; P$139 1.905,-3.175; P$140 0.635,-3.175; P$141 -0.635,-3.175; P$142 -1.905,-3.175; P$143 -3.175,-3.175; P$144 -4.445,-3.175; P$145 -5.715,-3.175; P$146 -6.985,-3.175; P$147 -8.255,-3.175; P$148 -9.525,-3.175; P$149 -10.795,-3.175; P$150 -12.065,-3.175; P$151 -13.335,-3.175; P$152 -14.605,-3.175; P$153 -15.875,-3.175; P$154 -17.145,-3.175; P$155 -18.415,-3.175; P$156 -19.685,-3.175; P$157 -20.955,-3.175; P$158 -22.225,-3.175; P$159 -23.495,-3.175; P$160 -24.765,-3.175 | hole 1.321: 27.165,0; -27.191,3.048
SMA_JACK_142-0701-201 = drill 1.575: CLK 0,0 | drill 1.702: GND$1 -2.54,2.54; GND$2 2.54,2.54; GND$3 -2.54,-2.54; GND$4 2.54,-2.54
SMA_JACK_CONREVSMA002-G = drill 1.397: CLK 0,0 | drill 1.448: GND$1 -2.54,2.54; GND$2 2.54,2.54; GND$3 -2.54,-2.54; GND$4 2.54,-2.54
JP3 = drill 0.914 long: 1 0,0; 2 2.54,0; 3 5.08,0
569-011X-X00_LED_ARRAY = drill 1.016 octagon: A1 -6.35,0; A2 -1.27,0; C1 -8.89,0; C2 -3.81,0
SOT23-GSD = smd 0.8 x 0.9: D 0,0; G -0.95,-2.1; S 0.95,-2.1
P1-13 = drill 1.321 pad 2.159 octagon: TP 0,0
TP06R = smd 0.6 x 0.6: TP 0,0
SOP65P490X110-9N = smd 1.422 x 0.432: 1 -2.184,0.965; 2 -2.184,0.33; 3 -2.184,-0.33; 4 -2.184,-0.965; 5 2.184,-0.965; 6 2.184,-0.33; 7 2.184,0.33; 8 2.184,0.965 | smd 1.575 x 1.88: 9 0,0
SOT-23-5 = smd 0.55 x 1: 1 -0.95,-1.35; 2 0,-1.35; 3 0.95,-1.35; 4 0.95,1.35; 5 -0.95,1.35
SOIC127P500X400-8N = smd 1.778 x 0.635: 1 -2.819,1.905; 2 -2.819,0.635; 3 -2.819,-0.635; 4 -2.819,-1.905; 5 2.819,-1.905; 6 2.819,-0.635; 7 2.819,0.635; 8 2.794,1.905
PDS1 = drill 1 octagon: P1 -5.08,0; P2 -2.54,0; P3 0,0; P4 2.54,0
FMC_SINGLE_WIDTH_MODULE = drill 2.7 pad 4: BEZ1 -54.6,59.05; BEZ2 -54.6,2.5
JP2 = drill 0.914 long: 1 0,0; 2 2.54,0

### Placement (x,y rotation side)
A  4.39,10.37 90 top
B  4.26,56.98 90 top
C1  23.56,44.78 270 top
C2  21.28,45.67 270 top
C3  25.85,49.99 90 top
C4  27.75,23.83 180 top
C5  25.34,34.24 180 top
C6  28.01,49.48 270 top
C7  34.74,43.77 270 top
C8  32.07,23.83 90 top
C9  32.33,34.24 270 top
C10  31.31,26.37 0 top
C11  36.52,43.77 270 top
C12  32.45,44.78 270 top
C13  34.1,49.48 90 top
C14  40.07,50.75 0 top
C15  36.64,26.37 90 top
C16  36.64,32.21 270 top
C17  51.63,32.21 270 top
C18  51.63,26.5 90 top
C19  48.2,50.75 0 top
C20  45.03,10.87 270 top
C21  49.09,9.73 270 top
C22  47.31,9.73 270 top
C23  33.85,11.76 270 top
C24  36.14,10.87 270 top
C25  67.76,56.34 90 bottom
C26  74.36,66.25 90 top
C27  67.76,53.16 90 bottom
C28  70.04,66.25 90 top
C29  67.76,59.52 90 bottom
C30  71.95,56.47 270 bottom
C31  71.95,59.52 270 bottom
C32  71.95,53.29 270 bottom
C_ISO  4.26,47.2 90 top
D1  14.29,38.56 270 bottom
D2  12.51,38.56 90 bottom
D3  14.29,30.43 270 bottom
D4  12.51,30.43 90 bottom
D5  14.29,22.3 270 bottom
D6  12.51,22.3 90 bottom
D7  28.26,10.87 0 top
D8  52.9,41.1 270 top
D9  55.69,41.1 270 top
D10  52.9,46.43 270 top
D11  55.69,46.43 270 top
D12  52.9,51.77 270 top
D13  55.69,51.77 270 top
DI_ISO  44.14,22.68 270 top
DO_ISO  44.14,36.02 90 top
FMC  67.63,34.5 270 bottom
G24  32.07,58.63 0 top
G25  53.41,58.63 0 top
G27  42.74,58.63 0 top
H13  4.39,24.08 0 top
H14  4.39,32.21 0 top
H23  4.39,40.34 0 top
L1  35.63,46.43 180 top
L2  48.2,12.53 180 top
POW_SEL  52.77,8.59 90 top
POW_TP  55.44,31.96 270 top
PWR_ISO  15.05,52.02 0 top
Q1  29.4,14.56 0 top
R1  9.97,40.34 0 bottom
R2  9.97,32.21 0 bottom
R3  9.97,24.08 0 bottom
R4  16.83,50.88 90 top
R5  19.5,45.67 270 top
R6  20.39,43.01 0 top
R7  18.86,50.88 90 top
R8  23.44,17.99 270 top
R9  23.44,21.03 270 top
R10  34.23,39.7 270 top
R11  29.28,9.1 180 top
R12  32.07,11.76 270 top
R13  32.96,9.1 0 top
R14  48.07,57.86 90 top
R15  37.41,60.15 90 top
R16  37.41,56.34 90 top
TP1  17.47,42.75 270 top
TP2  12.89,40.34 270 top
TP3  14.42,40.34 270 top
TP4  15.18,39.7 90 top
TP5  12.13,39.7 90 top
TP6  13.66,39.7 90 top
TP7  15.94,40.34 270 top
TP9  9.85,40.34 270 top
TP10  17.21,48.85 0 top
TP11  9.08,39.7 90 top
TP12  11.37,40.34 270 top
TP13  15.05,27.26 0 top
TP14  10.61,39.7 90 top
TP15  30.17,47.32 180 top
TP_CS  55.06,36.66 0 top
TP_H1  55.06,37.92 0 top
TP_H2  54.68,22.05 0 top
TP_H3  54.68,20.78 0 top
TP_MISO1  54.68,24.59 0 top
TP_MISO2  54.68,23.32 0 top
TP_MOSI  55.06,34.11 0 top
TP_SCLK  55.06,35.38 0 top
U1  28.01,44.78 0 top
U2  30.8,49.48 90 top
U3  29.02,29.92 180 top
U4  29.02,38.56 180 top
U5  29.02,19.51 0 top
U6  42.87,47.58 180 top
U7  40.58,10.87 0 top
U8  65.6,3 0 top
U$1  43.25,41.35 270 bottom
VDD_AUX  22.55,14.18 270 top

### Tracks (layer width: path | path; a pad name or v marks a point on that pad's centre or on a via)
12V_FPGA  (via drill 0.3, 0.9)
  Top 0.305: v70.17,53.55 FMC.P$155 | FMC.P$157 v70.17,56.09
  Top 0.406: 72.46,55.45 arc-90 72.58,55.32
  Top 0.61: 72.33,52.91 72.58,52.91 | C19.1 46.55,48.72 U6.P2
  Top 0.813: FMC.P$155 72.33,52.91 | FMC.P$157 72.46,55.45
  Top 1.016: C28.+ C26.+ 74.36,62.18 72.58,62.18 | POW_SEL.1 66.11,8.59 66.49,8.97 68.65,8.97 69.03,8.59 72.58,8.59 72.58,52.91 72.58,55.32 72.58,62.18 | v67.12,62.18 72.58,62.18 | v48.84,53.04 47.57,53.04 46.55,52.02 C19.1
  Bottom 0.305: C30.2 70.66,55.6 v70.17,56.09 | C32.2 71.29,52.43 v70.17,53.55
  Bottom 0.813: 62.81,60.28 65.22,60.28 66.23,61.29
  Bottom 1.016: v48.84,53.04 58.61,53.04 60.9,55.32 60.9,58.37 62.81,60.28 | v67.12,62.18 66.23,61.29
+3V3  (via drill 0.3, 0.48)
  Top 0.254: v50.74,19.51 DI_ISO.P10 | FMC.P$118 v68.9,57.36 | FMC.P$120 v70.17,58.63 FMC.P$159 | FMC.P$116 v68.9,54.82 | v52.9,50.88 D12.C | v52.9,40.21 D8.C | v52.9,45.55 D10.C
  Top 0.406: DO_ISO.P1 51.4,31.57 C17.2 v51.63,30.18 | DI_ISO.P16 51.27,27.13 C18.2 v51.63,28.53
  $VCC 0.254: 51.12,44.66 50.87,44.4
  Bottom 0.254: v68.9,57.36 68.88,57.33 67.89,57.33 C25.2 | v68.9,59.9 68.42,60.38 C29.2 | C31.2 70.2,58.65 v70.17,58.63 | v68.9,54.82 68.11,54.03 C27.2
  pour $VCC (rank 2): 80.84,80.47 13.78,80.47 13.78,62.21 arc-90 10.96,59.39 -15.68,59.39 -15.68,53.93 45.41,53.93 45.41,45.29 48.2,45.29 48.2,14.94 -15.68,14.94 -15.68,8.08 11.68,8.08 arc-90 13.66,6.1 13.66,-8.43 14.67,-8.43 80.84,-8.43
+3V3_ISO  (via drill 0.3, 0.48)
  Top 0.254: DO_ISO.P10 38.93,39.32 37.66,39.32 v37.53,39.45 | TP13.TP 14.42,27.26 v14.29,27.38
  Top 0.305: R7.1 19.98,50.02 v20.13,49.86
  Top 0.406: C16.2 36.36,31.45 | 29.53,23.95 C4.+ v28.01,23.83 | 32.07,23.07 C8.1 | v35.37,31.45 C16.2 | DO_ISO.P16 36.87,31.57 C16.2 | DI_ISO.P1 36.75,27.13 C15.2 v35.37,27.13 | U4.1 31.84,35.59 C9.1 31.28,35.11 v31.18,35.13 | U5.8 31.82,22.71 C8.1 | C8.1 33.32,22.96 v33.34,22.94 | v28.26,34.24 C5.+ | v29.28,26.37 C10.1 30.45,26.62 U3.1 | U2.5 29.45,49.05 29.02,49.48 25.98,49.48 | 25.72,48.47 C3.1
  Top 0.61: 25.98,49.48 25.72,49.23 25.72,48.47
  Bottom 0.254: D5.C v14.29,19.26 | D3.C v14.29,27.38 | v15.94,36.4 14.65,36.4 D1.C
  other vias: 24.07,49.86 24.07,48.97 24.07,48.09
  pour $VCC (isolate 0.254): -1.71,16.59 40.33,16.59 40.33,45.29 42.87,45.29 42.87,52.28 -1.71,52.28
  pour Top (no thermals): 23.69,50.24 26.36,50.24 27.12,50.24 27.12,47.83 23.69,47.83
+3V6  (via drill 0.3, 0.48)
  Top 0.254: B.B6 5.27,54.82 5.78,54.31 | A.B6 5.4,8.46 5.78,8.08 11.5,8.08 11.62,8.21
  Top 0.406: C24.1 36.82,11.84 U7.1 38.42,11.87 38.42,12.4
  Top 0.61: C24.1 33.95,12.53 C23.1 R12.1 v32.07,13.54 | 11.62,8.21 18.74,8.21 20.26,6.68 v32.07,6.68 65.98,6.68 66.62,6.05 68.52,6.05 69.16,6.68 74.24,6.68 v74.24,58.63 | 5.78,54.31 22.17,54.31 v26.1,58.24 | v38.42,13.67 38.42,12.4
  Bottom 0.61: v32.07,13.54 v32.07,6.68 | v26.1,58.24 26.1,63.45 28.39,65.74 60.39,65.74 62.55,63.58 74.24,63.58 v74.24,58.63 | v38.42,13.67 39.18,14.43 48.27,14.43 49.34,15.51 49.34,24.08 54.68,29.42 POW_TP.2
+3V6_ISO
  Top 0.254: TP10.TP 17.31,48.72 16.63,49.41
  Top 0.305: R4.1 16.76,49.94 16.5,49.53
  Top 0.406: U1.1 25.77,45.75 25.34,46.18 | 4.51,44.91 5.21,45.61 C_ISO.B6
  Top 0.61: 25.34,46.18 25.09,46.43 C1.1 23.05,46.43 22.95,46.54 C2.1 R5.1 16.63,49.41 16.5,49.53 16.43,49.61 1.97,49.61 1.34,48.97 1.34,45.55 1.97,44.91 4.51,44.91
+5V0  (via drill 0.3)
  Top 0.254: U2.1 31.24,48.53 31.06,48.72 31.06,50.24 31.31,50.5 32.09,50.5 U2.3 | U1.8 30.17,45.77 v30.17,46.43 TP15.TP | v30.17,43.01 30.19,43.03 U1.5
  Top 0.406: C11.1 L1.2 | C12.1 31.77,45.75 U1.8 | C13.1 32.24,48.44 U2.1
  Top 0.61: C12.1 L1.2 34.76,47.78 C13.1
  Bottom 0.254: v30.17,46.43 v30.17,43.01
+5V0_ISO-PRE
  Top 0.61: C14.1 40.33,48.85 U6.P4 37.63,47.58 L1.1
A_CS+  (via drill 0.3)
  Top 0.254: v5.4,12.65 A.B1 | v66.62,35.13 FMC.P$61
  Bottom 0.254: v5.4,12.65 6.04,12.02 17.97,12.02 21.66,9.1 27.5,9.1 31.31,5.29 54.42,5.29 55.69,6.56 55.69,23.7 57.98,25.99 57.98,31.45 62.04,35.51 66.23,35.51 v66.62,35.13
A_CS-  (via drill 0.3)
  Top 0.254: v7.56,12.78 7.37,12.78 A.T1 | v66.62,36.4 FMC.P$62
  Bottom 0.254: v7.56,12.78 18.23,12.78 22.17,9.6 27.75,9.6 31.56,5.79 53.92,5.79 55.19,7.06 55.19,23.92 57.47,26.21 57.47,31.7 61.92,36.15 66.36,36.15 v66.62,36.4
A_MISO1+  (via drill 0.3)
  Top 0.254: A.B4 5.34,9.98 v4.13,9.98 | v66.62,23.7 FMC.P$52
  Bottom 0.254: v4.13,9.98 12.39,9.98 17.09,6.05 25.98,6.05 29.79,2.24 57.47,2.24 58.74,3.51 58.74,20.04 62.65,23.95 66.36,23.95 v66.62,23.7
A_MISO1-  (via drill 0.3)
  Top 0.254: A.T4 6.61,9.98 13.66,9.98 v13.91,9.73 | v66.62,24.97 FMC.P$53
  Bottom 0.254: v13.91,9.73 17.85,6.56 26.23,6.56 30.04,2.75 56.96,2.75 58.23,4.02 58.23,20.27 62.55,24.59 66.23,24.59 v66.62,24.97
A_MISO2+  (via drill 0.3)
  Top 0.254: A.B5 5.34,9.35 v2.99,9.35 | v66.74,19.89 FMC.P$49
  Bottom 0.254: v2.99,9.35 10.74,9.35 15.82,5.03 25.47,5.03 29.28,1.22 58.49,1.22 59.76,2.49 59.76,17.61 62.3,20.14 66.49,20.14 v66.74,19.89
A_MISO2-  (via drill 0.3)
  Top 0.254: v11.88,9.22 11.69,9.41 A.T5 | v66.74,21.16 FMC.P$50
  Bottom 0.254: v11.88,9.22 16.32,5.54 25.72,5.54 29.53,1.73 57.98,1.73 59.25,3 59.25,17.86 62.17,20.78 66.36,20.78 v66.74,21.16
A_MOSI+  (via drill 0.3)
  Top 0.254: v2.99,10.75 3.05,10.68 A.B3 | v66.62,27.51 FMC.P$55
  Bottom 0.254: v2.99,10.75 14.16,10.75 18.61,7.06 26.48,7.06 30.29,3.25 56.46,3.25 57.73,4.52 57.73,21.16 64.46,27.89 66.23,27.89 v66.62,27.51
A_MOSI-  (via drill 0.3)
  Top 0.254: 6.61,10.75 A.T3 | 6.54,10.62 A.T3 | A.T3 15.5,10.68 v15.69,10.49 | v66.62,28.78 FMC.P$56
  Bottom 0.254: v15.69,10.49 19.37,7.57 26.74,7.57 30.55,3.76 55.95,3.76 57.22,5.03 57.22,21.41 64.33,28.53 66.36,28.53 v66.62,28.78
A_SCLK+  (via drill 0.3)
  Top 0.254: v4.13,11.51 4.32,11.32 A.B2 | v66.62,31.32 FMC.P$58
  Bottom 0.254: v4.13,11.51 4.39,11.26 16.2,11.26 20.13,8.08 26.99,8.08 30.8,4.27 55.44,4.27 56.71,5.54 56.71,21.92 59.5,24.72 59.5,29.16 62.04,31.7 66.23,31.7 v66.62,31.32
A_SCLK-  (via drill 0.3)
  Top 0.254: A.T2 17.4,11.32 v17.47,11.26 | v66.62,32.59 FMC.P$59
  Bottom 0.254: v17.47,11.26 20.9,8.59 27.25,8.59 31.06,4.78 54.93,4.78 56.2,6.05 56.2,22.18 59,24.97 59,29.42 61.92,32.34 66.36,32.34 v66.62,32.59
AGND1
  Top 0.406: U7.2 34.15,11.2 C23.2 R12.2 32.07,9.12 R13.1
AGND2
  Top 0.406: U1.2 23,45.11 22.67,44.78 21.3,44.78 C2.2 R5.2 19.5,43.03 R6.1
AUX_VDD
  Top 0.61: L2.1 51.38,12.53 POW_SEL.2
B_CS+  (via drill 0.3)
  Top 0.254: FMC.P$37 64.2,55.45 61.92,57.74 61.92,65.99 60.65,67.26 24.71,67.26 v17.34,59.9 | v5.27,59.26 B.B1
  Bottom 0.254: v17.34,59.9 16.7,59.26 v5.27,59.26
B_CS-
  Top 0.254: FMC.P$38 64.36,56.72 62.42,58.65 62.42,66.5 61.15,67.77 23.94,67.77 14.74,58.56 B.T1
B_MISO1+  (via drill 0.3)
  Top 0.254: v20.39,56.85 27.75,64.21 57.6,64.21 58.87,62.94 58.87,49.61 FMC.P$28 | v3.75,56.59 3.81,56.66 B.B4
  Bottom 0.254: v20.39,56.85 20.13,56.59 v3.75,56.59
B_MISO1-
  Top 0.254: FMC.P$29 59.38,50.37 59.38,63.45 58.11,64.72 27.25,64.72 19.12,56.59 6.42,56.59 B.T4
B_MISO2+  (via drill 0.3)
  Top 0.254: v21.4,55.83 28.77,63.2 56.58,63.2 57.85,61.93 57.85,46.81 FMC.P$25 | v2.48,55.83 4.51,55.83 4.64,55.96 5.21,55.96 B.B5
  Bottom 0.254: v2.48,55.83 v21.4,55.83
B_MISO2-
  Top 0.254: FMC.P$26 58.36,47.58 58.36,62.44 57.09,63.71 28.26,63.71 20.51,55.96 6.42,55.96 B.T5
B_MOSI+  (via drill 0.3)
  Top 0.254: FMC.P$31 64.27,47.83 59.88,52.22 59.88,63.96 58.61,65.23 26.74,65.23 v19.5,57.99 | v2.48,57.36 5.27,57.36 B.B3
  Bottom 0.254: v2.48,57.36 18.86,57.36 v19.5,57.99
B_MOSI-
  Top 0.254: FMC.P$32 64.2,49.1 60.39,52.91 60.39,64.47 59.12,65.74 26.18,65.74 17.73,57.29 B.T3
B_SCLK+  (via drill 0.3)
  Top 0.254: FMC.P$34 60.9,55.21 60.9,64.98 59.63,66.25 25.72,66.25 v18.36,58.88 | B.B2 3.88,57.93 v3.75,58.05
  Bottom 0.254: v18.36,58.88 17.53,58.05 v3.75,58.05
B_SCLK-
  Top 0.254: FMC.P$35 64.41,52.91 61.41,55.91 61.41,65.48 60.14,66.75 25.21,66.75 16.39,57.93 B.T2
CS
  Top 0.254: 64.2,36.66 FMC.P$22
  Top 0.381: 64.2,36.66 TP_CS.TP DO_ISO.P5
CS+_ISOLATED  (via drill 0.3)
  Top 0.254: C_ISO.B1 3.94,48.78 v3.88,48.85 | U4.7 25.59,37.92 25.21,37.54 16.32,37.54 15.94,37.92 15.94,38.31 TP7.TP 15.94,46.18 v13.78,48.34
  Bottom 0.254: v3.88,48.85 13.28,48.85 v13.78,48.34
CS-_ISOLATED
  Top 0.254: C_ISO.T1 12.39,48.78 15.18,45.99 TP4.TP 15.18,38.05 15.18,37.67 15.82,37.04 25.21,37.04 25.59,36.66 U4.8
CS_ISO
  Top 0.381: U4.2 32.96,37.92 34.23,36.66 DO_ISO.P12
G24  (via drill 0.3)
  Top 0.254: v37.66,54.56 37.66,55.07 37.56,55.32 R16.1 | D8.A 52.98,42.8 53.15,42.62 v54.17,42.62 | v57.47,39.32 57.39,39.4 55.79,39.4 D9.C | v66.62,38.94 FMC.P$64
  Bottom 0.254: v37.66,54.56 37.91,54.31 45.28,54.31 54.17,45.42 v54.17,42.62 v57.47,39.32 57.85,38.94 v66.62,38.94
G25  (via drill 0.3)
  Top 0.254: D11.C 55.69,45.09 | 55.77,44.66 D11.C | R14.1 48.07,55.83 51.63,52.28 51.63,49.23 52.62,48.23 D10.A | 53.41,48.47 53.23,48.47 D10.A | D10.A 52.98,48.13 55.69,45.42 D11.C | 55.87,44.73 D11.C | v57.22,43.64 56.22,44.63 D11.C | v66.62,40.21 FMC.P$65
  Bottom 0.254: v57.22,43.64 60.65,40.21 v66.62,40.21
G27  (via drill 0.3)
  Top 0.254: R15.1 38.02,59.29 39.44,57.86 41.09,57.86 42.1,56.85 43.5,56.85 44.52,57.86 51.63,57.86 52.9,56.59 D12.A 52.98,53.47 52.98,52.68 D13.C 55.97,49.97 57.22,48.72 v57.22,45.16 | FMC.P$67 v66.62,42.75
  Bottom 0.254: v57.22,45.16 59.63,42.75 v66.62,42.75
GND  (via drill 0.3, 0.48, 0.8)
  Top 0.254: FMC.P$36 v65.09,54.82 | FMC.P$39 v65.09,57.36 | FMC.P$33 v65.09,51.01 | FMC.P$24 v65.09,39.58 | FMC.P$27 v65.09,42.12 | FMC.P$30 v65.09,47.2 | v70.17,51.01 FMC.P$153 | FMC.P$152 v70.17,49.74 | v70.17,34.5 FMC.P$140 | v70.17,35.77 FMC.P$141 | v65.09,38.31 FMC.P$63 | v65.09,40.85 FMC.P$66 | v65.09,45.93 FMC.P$69 | v65.09,48.47 FMC.P$72 | v65.09,52.28 FMC.P$75 | v65.09,56.09 FMC.P$78 | v65.09,58.63 FMC.P$80 | v70.17,30.69 FMC.P$137 | FMC.P$136 v70.17,29.42 | v70.17,25.61 FMC.P$133 | v70.17,23.07 FMC.P$132 | FMC.P$129 v70.17,19.26 | FMC.P$128 v70.17,17.99 | FMC.P$44 v65.09,12.91 | v70.17,10.37 FMC.P$121 | FMC.P$124 v70.17,12.91 FMC.P$83 | v70.17,14.18 FMC.P$125 | v70.17,44.66 FMC.P$148 | FMC.P$149 v70.17,45.93 | v70.17,38.31 FMC.P$144 | v70.17,40.85 FMC.P$145 | v65.09,21.8 FMC.P$51 | v65.09,25.61 FMC.P$54 | v65.09,29.42 FMC.P$57 | v65.09,17.99 FMC.P$48 | v65.09,10.37 FMC.P$41 | FMC.P$3 v65.09,11.64 | FMC.P$60 v65.09,34.5 FMC.P$21 | v70.17,36.91 FMC.P$102 | v70.17,39.58 FMC.P$105 | v70.17,43.39 FMC.P$108 | FMC.P$93 v70.17,24.34 | FMC.P$90 v70.17,20.53 | FMC.P$87 v70.17,16.72 | FMC.P$99 v70.17,31.96 | FMC.P$86 v70.17,15.45 | FMC.P$82 v70.17,11.64 | FMC.P$96 v70.17,28.15 | v65.09,30.69 FMC.P$18 | FMC.P$9 v65.09,19.26 | FMC.P$6 v65.09,15.45 | FMC.P$45 v65.09,14.18 | FMC.P$12 v65.09,23.07 | FMC.P$15 v65.09,26.88 | FMC.P$119 v68.9,58.63 | FMC.P$117 v68.9,56.09 | B.T6 7.5,55.39 v7.69,55.2 | D11.A 55.87,48.13 55.69,47.96 v55.69,47.32 | D9.A 55.87,42.8 55.69,42.62 v55.69,41.99 | D13.A v55.69,52.02
  Top 0.305: A.T6 6.61,8.71 v7.81,8.71
  Top 0.406: FMC.P$156 v70.17,54.82 | v70.17,59.9 FMC.P$160 | v70.17,57.36 FMC.P$158 | DO_ISO.P2 51.4,32.84 C17.1 51.65,33.1 v52.9,33.1 | DI_ISO.P15 51.53,25.86 C18.1 51.65,25.73 v52.9,25.73 | DO_ISO.P8 v49.22,41.23 | DI_ISO.P9 v50.99,18.24
  Top 0.61: C19.2 47.95,48.85 U6.P1 | R11.1 31.28,7.95 v33.34,7.95
  Top 1.016: C28.- v72.2,67.64 C26.-
  $GND 0.254: 54.42,47.96 56.2,48.21 | 56.71,42.88 56.2,42.88
  Bottom 0.254: v68.9,58.63 68.88,58.65 C29.1 | v68.9,56.09 68.24,56.09 C25.1 | C31.1 70.66,60.38 v70.17,59.9 | C30.1 70.2,57.33 v70.17,57.36 | v68.77,52.28 68.77,52.3 C27.1
  Bottom 0.305: C32.1 70.83,54.16 v70.17,54.82
  other vias: 40.58,10.24 40.58,11.51 50.23,7.95 50.23,9.6 48.2,7.95 46.04,7.95 43.76,7.95 41.6,7.95 41.72,12.91 39.56,12.91 39.31,7.95 37.41,7.95 35.25,7.95
  pour $GND (rank 2): 80.84,80.47 80.84,-8.43 13.66,-8.43 13.66,6.03 arc90 11.61,8.08 -15.68,8.08 -15.68,14.94 48.2,14.94 48.2,45.29 45.41,45.29 45.41,53.93 -15.68,53.93 -15.68,59.39 10.93,59.39 arc90 13.78,62.24 13.78,80.47
  pour Top (no thermals): 50.61,7.7 50.61,11 41.98,11 41.98,13.29 39.18,13.29 39.18,10.11 32.96,10.11 32.96,7.7
GND_ISO  (via drill 0.3, 0.48)
  Top 0.254: R10.1 35.22,40.57 v35.25,40.59
  Top 0.305: C_ISO.T6 v6.42,44.91
  Top 0.406: v33.34,26.37 C10.2 | v24.71,23.83 C4.- | DO_ISO.P15 36.87,32.84 C16.1 36.62,33.1 v35.37,33.1 | DI_ISO.P2 37,25.86 C15.1 36.49,25.35 v35.37,25.35 | DO_ISO.P9 v37.28,40.47 | v37.28,18.24 DI_ISO.P8 | U5.5 v30.17,17.61 | U3.4 v30.17,31.83 | C9.2 32.43,33.38 v31.18,33.35 | C8.2 33.32,24.69 v33.34,24.72 | v24.96,34.24 C5.- | U4.4 v30.17,40.47
  Top 0.61: C3.2 v27.63,51.64 | C6.2 28.01,46.81 27.88,46.69 | v34.1,51.64 C13.2 33.06,49.48 U2.2 | C14.2 41.72,48.72 U6.P3
  Bottom 0.254: D6.A v12.51,19.26 | D4.A v12.51,27.38 | v16.58,35.51 13.76,35.51 D2.A
  other vias: 28.01,44.15 28.01,45.42 37.66,41.86 37.66,43.51 35.63,41.86 33.47,41.86 31.18,41.86 29.02,41.86 29.15,46.81 26.99,46.81 26.74,41.86 24.83,41.86 22.67,41.86 20.77,41.86
  pour $GND (isolate 0.254): -1.71,16.59 40.33,16.59 40.33,45.29 42.87,45.29 42.87,52.28 -1.71,52.28
  pour Top (no thermals): 38.04,41.61 38.04,44.91 29.4,44.91 29.4,47.2 26.61,47.2 26.61,44.02 20.39,44.02 20.39,41.61
H13
  Top 0.381: FMC.P$13 60.27,20.78 TP_H3.TP DI_ISO.P11
H13_ISO  (via drill 0.3)
  Top 0.254: DI_ISO.P6 v37.53,20.78
  Bottom 0.254: v37.53,20.78 18.74,20.78 15.41,24.1 D5.A D6.C 10.86,24.1 R3.1
H14
  Top 0.381: FMC.P$14 60.27,22.05 TP_H2.TP DI_ISO.P12
H14_ISO  (via drill 0.3)
  Top 0.254: DI_ISO.P5 v37.53,22.05
  Bottom 0.254: v37.53,22.05 18.48,22.05 16.58,23.95 16.58,30.43 14.78,32.23 D3.A D4.C 12.49,32.21 R2.1
H23
  Top 0.254: 64.2,37.92 FMC.P$23
  Top 0.381: 64.2,37.92 TP_H1.TP DO_ISO.P6
H23_ISO  (via drill 0.3)
  Top 0.254: v37.53,37.92 DO_ISO.P11
  Bottom 0.254: v37.53,37.92 29.15,37.92 26.74,40.34 14.29,40.34 D1.A D2.C 10.86,40.36 R1.1
MISO1
  Top 0.381: DI_ISO.P14 TP_MISO1.TP 59,24.59 FMC.P$17
MISO1+_ISOLATED  (via drill 0.3)
  Top 0.254: C_ISO.B4 2.42,46.88 v2.35,46.81 | 26.18,20.17 U5.2 27.37,20.14 27.75,20.53 27.75,21.67 27.25,22.18 24.32,22.18 24.05,21.9 R9.1 22.83,21.29 22.17,21.29 21.4,22.05 21.4,25.1 11.37,35.13 TP12.TP 11.37,45.04 v10.1,46.31
  Bottom 0.254: v2.35,46.81 9.59,46.81 v10.1,46.31
MISO1-_ISOLATED
  Top 0.254: C_ISO.T4 8.58,46.88 10.61,44.85 TP14.TP 10.61,34.88 20.9,24.59 20.9,21.54 21.66,20.78 22.83,20.78 R9.2 23.97,20.17 25.21,21.41 U5.1
MISO1_ISO
  Top 0.381: U5.7 33.21,20.14 37.66,24.59 DI_ISO.P3
MISO2
  Top 0.381: DI_ISO.P13 TP_MISO2.TP 58.49,23.32 59,23.32 FMC.P$16
MISO2+_ISOLATED  (via drill 0.3)
  Top 0.254: C_ISO.B5 3.94,46.24 v3.88,46.18 | 23.16,18.85 R8.1 | R8.1 23.46,18.88 U5.3 | R8.1 22.83,18.24 22.17,18.24 20.13,20.27 20.13,24.08 9.85,34.37 TP9.TP 9.85,44.53 v8.7,45.67
  Bottom 0.254: v3.88,46.18 8.2,46.18 v8.7,45.67
MISO2-_ISOLATED
  Top 0.254: C_ISO.T5 7.18,46.24 9.08,44.34 9.08,44.15 TP11.TP 9.08,34.24 19.63,23.7 19.63,19.76 21.66,17.73 22.83,17.73 R8.2 | 23.16,17.12 R8.2 | R8.2 23.92,17.61 U5.4
MISO2_ISO
  Top 0.381: U5.6 33.09,18.88 37.53,23.32 DI_ISO.P4
MOSI
  Top 0.381: FMC.P$19 62.93,34.11 TP_MOSI.TP DO_ISO.P3
MOSI_ISO
  Top 0.381: DO_ISO.P14 34.99,34.11 34.48,33.61 34.48,30.81 32.96,29.29 U3.2
N$1
  Top 0.406: C22.1 47.26,10.54 U7.6
N$2
  Top 0.254: R16.2 36.54,57.2 35.12,58.63 G24.CLK
N$3
  Top 0.61: 30.35,11.04 D7.C 30.35,11.17 Q1.S 30.35,13.6 31.31,14.56 51.88,14.56 POW_SEL.3
N$4
  Top 0.406: U1.6 34.74,44.45 C7.1
N$5
  Top 0.254: U4.3 33.87,39.2 R10.2
N$6
  Top 0.61: R11.2 28.24,9.1 D7.A 26.87,10.87 Q1.G
N$7
  Top 0.61: Q1.D 22.93,14.56 VDD_AUX.1
N$8
  Top 0.305: R4.2 14.06,51.74 PWR_ISO.A2
N$10
  Top 0.305: PWR_ISO.A1 8.7,51.26 9.34,50.62 15.69,50.62 15.94,50.88 18,50.88 R7.2
N$11
  Bottom 0.254: H23.CLK R1.2
N$12  (via drill 0.3)
  Top 0.254: C_ISO.B3 3.94,47.51 v3.88,47.58 | U3.7 25.72,29.29 25.34,28.91 19.88,28.91 12.89,35.89 TP2.TP 12.89,45.42 v11.24,47.07
  Bottom 0.254: v3.88,47.58 10.74,47.58 v11.24,47.07
N$13
  Top 0.254: U3.8 25.72,28.02 25.34,28.4 19.37,28.4 12.13,35.64 12.13,36.15 TP5.TP 12.13,45.23 9.85,47.51 C_ISO.T3
N$14
  Bottom 0.254: R2.2 H14.CLK
N$15  (via drill 0.3)
  Top 0.254: U3.6 27.25,30.56 27.88,31.19 27.88,31.96 27.25,32.59 18.61,32.59 14.42,36.78 14.42,37.16 TP3.TP 14.42,45.8 v12.51,47.7 | C_ISO.B2 5.27,48.21 v2.35,48.21
  Bottom 0.254: v2.35,48.21 12.01,48.21 v12.51,47.7
N$16
  Top 0.254: U3.5 26.2,31.85 25.98,32.08 18.1,32.08 13.66,36.53 13.66,36.66 TP6.TP 13.66,45.67 11.12,48.21 6.48,48.21 C_ISO.T2
N$17
  Bottom 0.254: H13.CLK R3.2
N$18
  Top 0.254: G25.CLK 48.18,58.63 R14.2
N$19
  Top 0.254: G27.CLK 40.05,58.63 R15.2
N$97
  Top 0.406: U2.4 29.43,50.45 28.12,50.45 C6.1
SCLK
  Top 0.381: FMC.P$20 62.93,35.38 TP_SCLK.TP DO_ISO.P4
SCLK_ISO
  Top 0.381: U3.3 32.88,30.56 33.6,31.28 33.6,33.86 34.99,35.38 DO_ISO.P13
TDI-TDO
  Top 0.254: FMC.P$111 FMC.P$110
VDD_POST_LC  (via drill 0.3)
  Top 0.254: U7.8 42.74,11.87 v42.74,12.53 | v42.74,9.1 42.76,9.12 U7.5
  Top 0.406: C21.1 47.34,12.35 L2.2 | C20.1 44.34,11.84 U7.8
  Top 0.61: L2.2 C20.1
  Bottom 0.254: v42.74,12.53 v42.74,9.1

### Text on the board
tPlace: direct FMC 3.3V ONLY | B | C | isolated | +3v3 | +3v6 | GND | from FMC H23 | isolated | to FMC H13 | to FMC H14 | + | VDD_AUX | - | A | COMMON | FMC_12P0V
bPlace: direct FMC 3.3V ONLY | G21 | G24 | G22 | B | C | isolated | from FMC H23 | to FMC H14 | FMC IO Module / Rev. 0.1 / 2016.03 | to FMC H13 | A